# EAGLE design V7B TI (EAGLE 6.4)

## Sheet 1 of 3
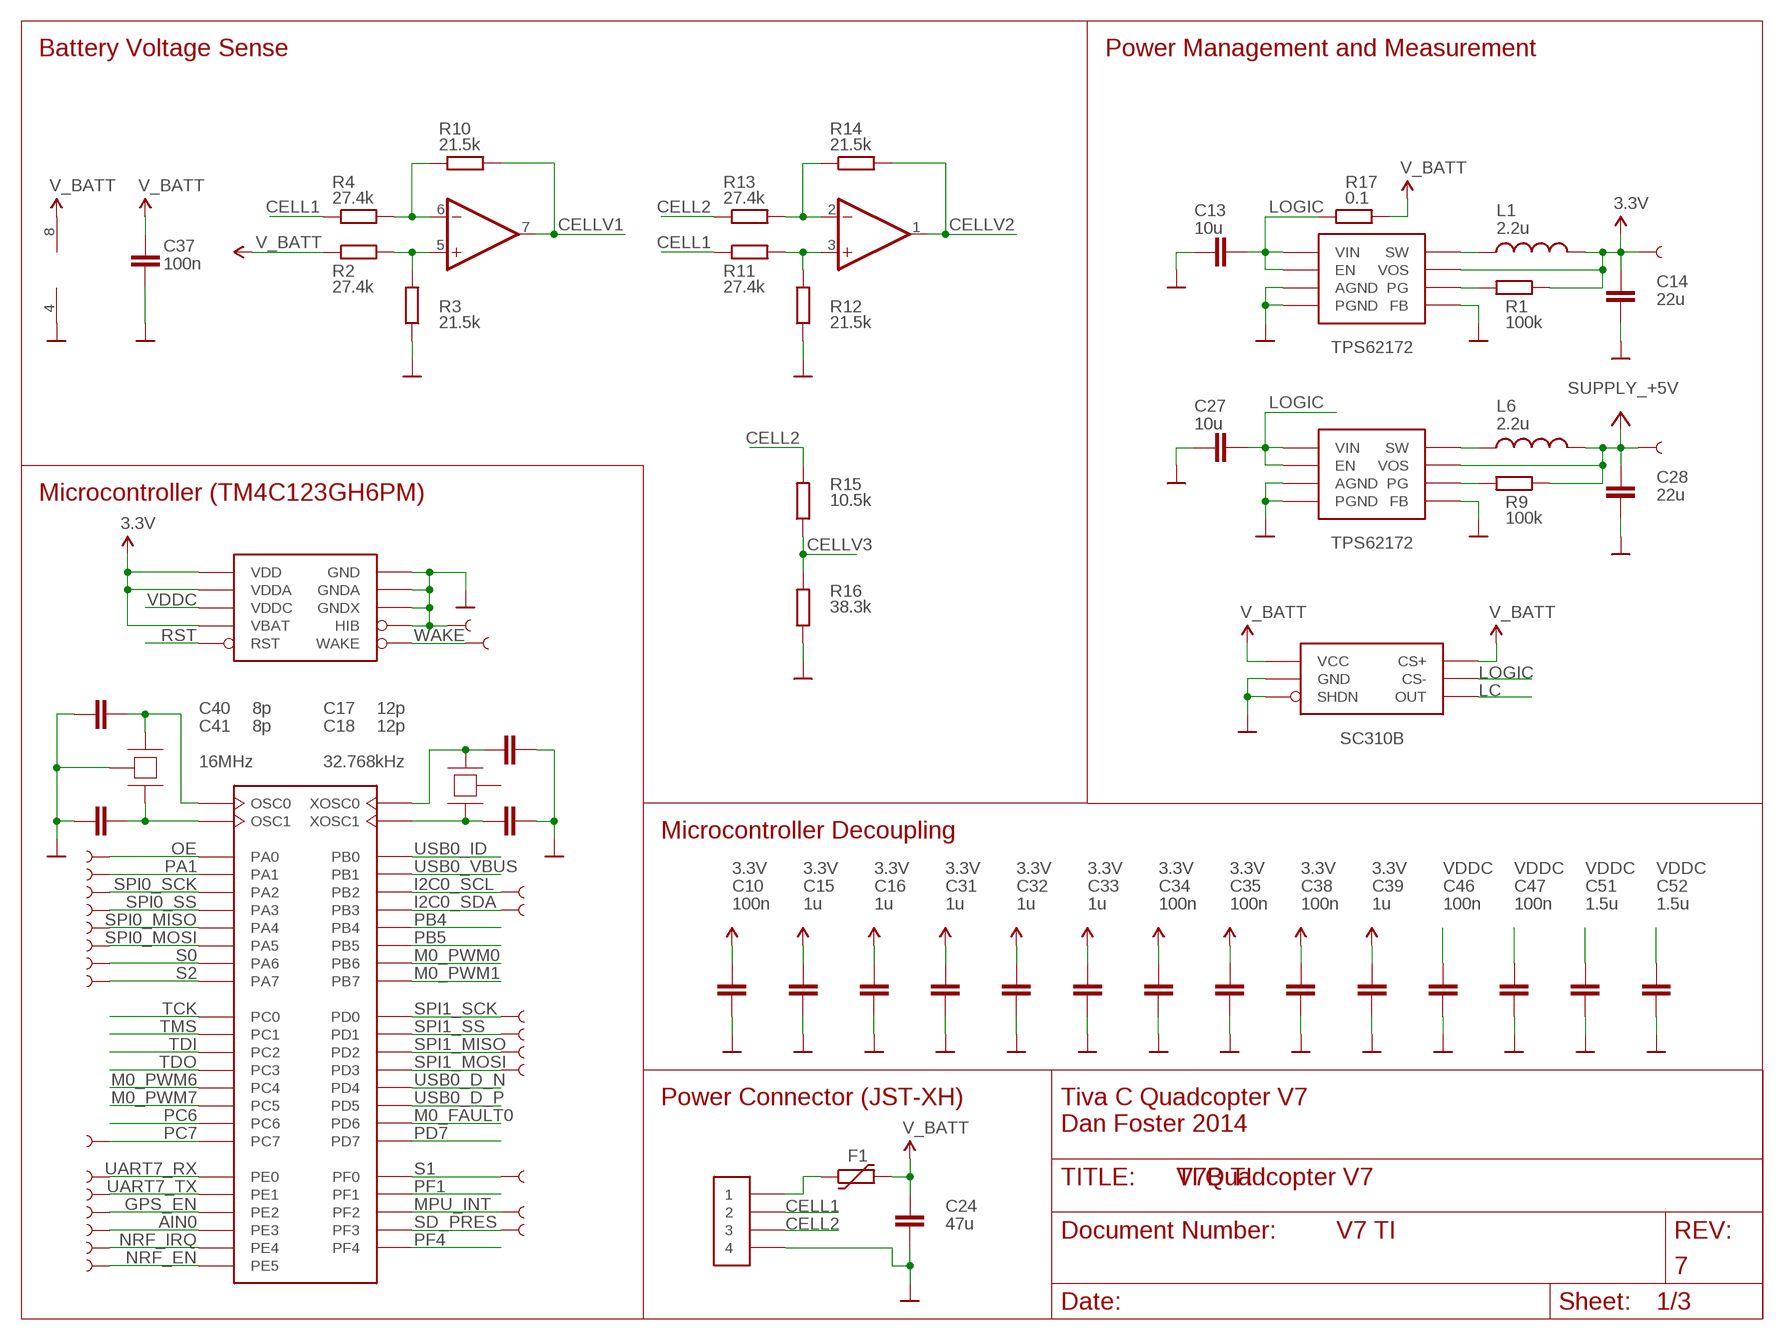
[diagram p0: schematic, sheet 1]

### Parts
C10  100n  CAPACITOR_NPOL-0402  [C402]
C13  10u  CAPACITOR_NPOL-0805  [C805]
C14  22u  CAPACITOR_NPOL-0805  [C805]
C15  1u  CAPACITOR_NPOL-0402  [C402]
C16  1u  CAPACITOR_NPOL-0402  [C402]
C17  12p  CAPACITOR_NPOL-0402  [C402]
C18  12p  CAPACITOR_NPOL-0402  [C402]
C24  47u  CAPACITOR_NPOL-1206  [C1206]
C27  10u  CAPACITOR_NPOL-0805  [C805]
C28  22u  CAPACITOR_NPOL-0805  [C805]
C31  1u  CAPACITOR_NPOL-0402  [C402]
C32  1u  CAPACITOR_NPOL-0402  [C402]
C33  1u  CAPACITOR_NPOL-0402  [C402]
C34  100n  CAPACITOR_NPOL-0402  [C402]
C35  100n  CAPACITOR_NPOL-0402  [C402]
C37  100n  CAPACITOR_NPOL-0402  [C402]
C38  100n  CAPACITOR_NPOL-0402  [C402]
C39  1u  CAPACITOR_NPOL-0402  [C402]
C40  8p  CAPACITOR_NPOL-0402  [C402]
C41  8p  CAPACITOR_NPOL-0402  [C402]
C46  100n  CAPACITOR_NPOL-0402  [C402]
C47  100n  CAPACITOR_NPOL-0402  [C402]
C51  1.5u  CAPACITOR_NPOL-0402  [C402]
C52  1.5u  CAPACITOR_NPOL-0402  [C402]
F1  FUSE_PTC-1812  [PTC1812L]
IC2  OPA2743EA  [MSOP08]
L1  2.2u  INDUCTOR1210  [1210]
L6  2.2u  INDUCTOR1210  [1210]
R1  100k  RESISTOR-0402  [R402]
R2  27.4k  RESISTOR-0402  [R402]
R3  21.5k  RESISTOR-0402  [R402]
R4  27.4k  RESISTOR-0402  [R402]
R9  100k  RESISTOR-0402  [R402]
R10  21.5k  RESISTOR-0402  [R402]
R11  27.4k  RESISTOR-0402  [R402]
R12  21.5k  RESISTOR-0402  [R402]
R13  27.4k  RESISTOR-0402  [R402]
R14  21.5k  RESISTOR-0402  [R402]
R15  10.5k  RESISTOR-0402  [R402]
R16  38.3k  RESISTOR-0402  [R402]
R17  0.1  RESISTOR-1206  [R1206]
TP1  TEST-POINT3  [PAD.03X.03]
TP2  TEST-POINT3  [PAD.03X.03]
TP3  TEST-POINT3  [PAD.03X.03]
TP4  TEST-POINT3  [PAD.03X.03]
TP5  TEST-POINT3  [PAD.03X.03]
TP6  TEST-POINT3  [PAD.03X.03]
TP7  TEST-POINT3  [PAD.03X.03]
TP8  TEST-POINT3  [PAD.03X.03]
TP9  TEST-POINT3  [PAD.03X.03]
TP10  TEST-POINT3  [PAD.03X.03]
TP11  TEST-POINT3  [PAD.03X.03]
TP12  TEST-POINT3  [PAD.03X.03]
TP13  TEST-POINT3  [PAD.03X.03]
TP14  TEST-POINT3  [PAD.03X.03]
TP15  TEST-POINT3  [PAD.03X.03]
TP16  TEST-POINT3  [PAD.03X.03]
TP17  TEST-POINT3  [PAD.03X.03]
TP18  TEST-POINT3  [PAD.03X.03]
TP19  TEST-POINT3  [PAD.03X.03]
TP20  TEST-POINT3  [PAD.03X.03]
TP21  TEST-POINT3  [PAD.03X.03]
TP22  TEST-POINT3  [PAD.03X.03]
TP23  TEST-POINT3  [PAD.03X.03]
TP24  TEST-POINT3  [PAD.03X.03]
TP25  TEST-POINT3  [PAD.03X.03]
TP26  TEST-POINT3  [PAD.03X.03]
TP27  TEST-POINT3  [PAD.03X.03]
TP29  TEST-POINT3  [PAD.03X.03]
U$2  TPS62172  [S-PWSON-N8]
U$4  TPS62172  [S-PWSON-N8]
U$5  TM4C123GH6PM  [TI-PM]
U$6  JST-XH-4-SMD  [JST-XH-4-SMD]
U$7  CRYSTAL-3.2X2.5  [TSX-3225]
U$9  SC130  [SOT-23-6]
U$12  CRYSTAL-WATCH-SMD  [CRYSTAL-WATCH-SMD]

### Nets
3.3V: C10.1 C14.2 C15.1 C16.1 C31.1 C32.1 C33.1 C34.1 C35.1 C38.1 C39.1 L1.2 R1.1 TP15.P$1 U$2.6(VOS) U$5.P$2(VDDA) U$5.P$11(VDD) U$5.P$26(VDD) U$5.P$37(VBAT) U$5.P$42(VDD) U$5.P$54(VDD) ; also sheet 2,3
+5V: C28.2 L6.2 R9.1 TP14.P$1 U$4.6(VOS) ; supply symbol labelled SUPPLY_+5V ; also sheet 3
AIN0: TP11.P$1 U$5.P$6(PE3) ; also sheet 3
CELL1: R4.1 R11.1 U$6.2
CELL2: R13.1 R15.2 U$6.3
CELLV1: IC2.7(B:OUT) R10.2 ; also sheet 3
CELLV2: IC2.1(A:OUT) R14.2 ; also sheet 3
CELLV3: R15.1 R16.2 ; also sheet 3
GND: C10.2 C13.2 C14.1 C15.2 C16.2 C17.2 C18.2 C24.2 C27.2 C28.1 C31.2 C32.2 C33.2 C34.2 C35.2 C37.2 C38.2 C39.2 C40.1 C41.1 C46.2 C47.2 C51.2 C52.2 IC2.4(P:V-) R3.1 R12.1 R16.1 TP16.P$1 U$2.1(PGND) U$2.4(AGND) U$2.5(FB) U$2.PAD(AGND) U$2.VIA1(AGND) U$2.VIA2(AGND) U$4.1(PGND) U$4.4(AGND) U$4.5(FB) U$4.PAD(AGND) U$4.VIA1(AGND) U$4.VIA2(AGND) U$5.P$3(GNDA) U$5.P$12(GND) U$5.P$27(GND) U$5.P$33(HIB) U$5.P$35(GNDX) U$5.P$39(GND) U$5.P$55(GND) U$6.4 U$7.G1(CASE) U$7.G2(CASE) U$9.1(SHDN) U$9.2(GND) ; supply symbol labelled SUPPLY_GND ; also sheet 2,3
GPS_EN: TP21.P$1 U$5.P$7(PE2) ; also sheet 2
I2C0_SCL: TP5.P$1 U$5.P$47(PB2) ; also sheet 2
I2C0_SDA: TP6.P$1 U$5.P$48(PB3) ; also sheet 2
LC: U$9.6(OUT) ; also sheet 3
LOGIC: C13.1 C27.1 R17.1 U$2.2(VIN) U$2.3(EN) U$4.2(VIN) U$4.3(EN) U$9.5(CS-)
M0_FAULT0: U$5.P$53(PD6)
M0_PWM0: U$5.P$1(PB6) ; also sheet 3
M0_PWM1: U$5.P$4(PB7) ; also sheet 3
M0_PWM6: U$5.P$16(PC4) ; also sheet 3
M0_PWM7: U$5.P$15(PC5) ; also sheet 3
MPU_INT: TP29.P$1 U$5.P$30(PF2) ; also sheet 2
N$6: IC2.5(B:+IN) R2.2 R3.2
N$7: L1.1 U$2.7(SW)
N$8: C17.1 U$5.P$34(XOSC0) U$12.2(C2)
N$9: R1.2 U$2.8(PG)
N$10: IC2.6(B:-IN) R4.2 R10.1
N$11: C18.1 U$5.P$36(XOSC1) U$12.1(C1)
N$16: L6.1 U$4.7(SW)
N$19: R9.2 U$4.8(PG)
N$20: F1.1 U$6.1
N$24: IC2.3(A:+IN) R11.2 R12.2
N$25: IC2.2(A:-IN) R13.2 R14.1
N$27: C40.2 U$5.P$40(OSC0) U$7.C1
N$30: C41.2 U$5.P$41(OSC1) U$7.C2
NRF_EN: TP19.P$1 U$5.P$60(PE5) ; also sheet 2,3
NRF_IRQ: TP18.P$1 U$5.P$59(PE4) ; also sheet 2
OE: TP24.P$1 U$5.P$17(PA0) ; also sheet 3
PA1: TP25.P$1 U$5.P$18(PA1)
PB4: U$5.P$58(PB4)
PB5: U$5.P$57(PB5)
PC6: U$5.P$14(PC6)
PC7: TP27.P$1 U$5.P$13(PC7)
PD7: U$5.P$10(PD7)
PF1: U$5.P$29(PF1)
PF4: U$5.P$5(PF4)
RST: U$5.P$38(RST) ; also sheet 2,3
S0: TP12.P$1 U$5.P$23(PA6) ; also sheet 3
S1: TP10.P$1 U$5.P$28(PF0) ; also sheet 3
S2: TP13.P$1 U$5.P$24(PA7) ; also sheet 3
SD_PRES: TP20.P$1 U$5.P$31(PF3) ; also sheet 2
SPI0_MISO: TP3.P$1 U$5.P$21(PA4) ; also sheet 2,3
SPI0_MOSI: TP4.P$1 U$5.P$22(PA5) ; also sheet 2
SPI0_SCK: TP1.P$1 U$5.P$19(PA2) ; also sheet 2
SPI0_SS: TP2.P$1 U$5.P$20(PA3) ; also sheet 2,3
SPI1_MISO: TP9.P$1 U$5.P$63(PD2) ; also sheet 2,3
SPI1_MOSI: TP17.P$1 U$5.P$64(PD3) ; also sheet 2
SPI1_SCK: TP7.P$1 U$5.P$61(PD0) ; also sheet 2
SPI1_SS: TP8.P$1 U$5.P$62(PD1) ; also sheet 2,3
TCK: U$5.P$52(PC0) ; also sheet 2
TDI: U$5.P$50(PC2) ; also sheet 2
TDO: U$5.P$49(PC3) ; also sheet 2
TMS: U$5.P$51(PC1) ; also sheet 2
UART7_RX: TP23.P$1 U$5.P$9(PE0) ; also sheet 2
UART7_TX: TP22.P$1 U$5.P$8(PE1) ; also sheet 2
USB0_D_N: U$5.P$43(PD4)
USB0_D_P: U$5.P$44(PD5)
USB0_ID: U$5.P$45(PB0)
USB0_VBUS: U$5.P$46(PB1)
V_BATT: C24.1 C37.1 F1.2 IC2.8(P:V+) R2.1 R17.2 U$9.3(VCC) U$9.4(CS+)
VDDC: C46.1 C47.1 C51.1 C52.1 U$5.P$25(VDDC) U$5.P$56(VDDC)
WAKE: TP26.P$1 U$5.P$32(WAKE) ; also sheet 3

### Notes on the sheet
- Battery Voltage Sense | Power Management and Measurement
- TPS62172
- Microcontroller (TM4C123GH6PM)
- TPS62172
- SC310B
- 16MHz | 32.768kHz
- Microcontroller Decoupling
- Power Connector (JST-XH)
- Tiva C Quadcopter V7
  Dan Foster 2014
- TI Quadcopter V7
- V7 TI
- 7

## Sheet 2 of 3
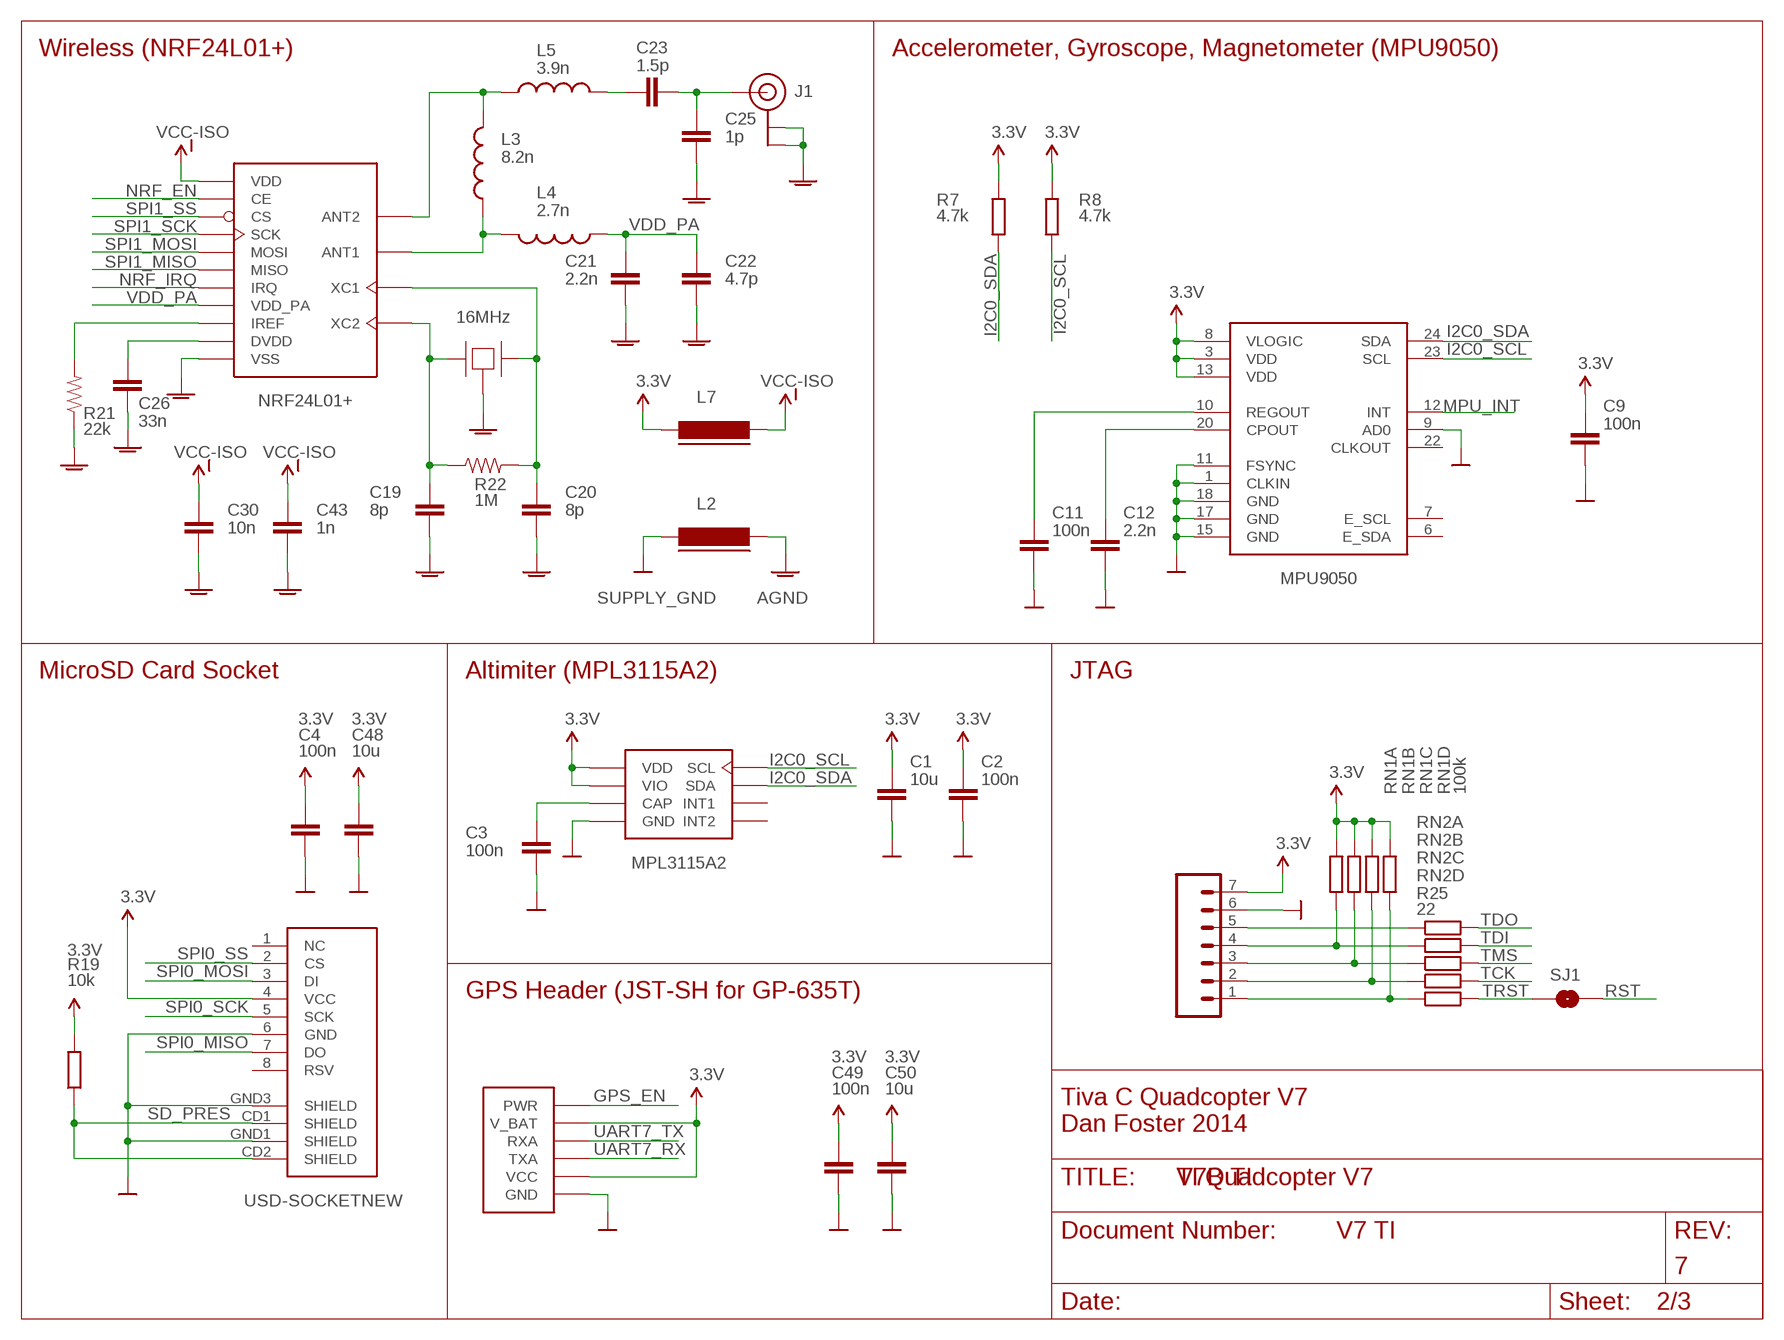
[diagram p1: schematic, sheet 2]

### Parts
C1  10u  CAPACITOR_NPOL-0603  [C603]
C2  100n  CAPACITOR_NPOL-0402  [C402]
C3  100n  CAPACITOR_NPOL-0402  [C402]
C4  100n  CAPACITOR_NPOL-0402  [C402]
C9  100n  CAPACITOR_NPOL-0402  [C402]
C11  100n  CAPACITOR_NPOL-0402  [C402]
C12  2.2n  CAPACITOR_NPOL-0402  [C402]
C19  8p  CAP0402-CAP  [0402-CAP]
C20  8p  CAP0402-CAP  [0402-CAP]
C21  2.2n  CAP0402-CAP  [0402-CAP]
C22  4.7p  CAP0402-CAP  [0402-CAP]
C23  1.5p  CAP0402-CAP  [0402-CAP]
C25  1p  CAP0402-CAP  [0402-CAP]
C26  33n  CAP0402-CAP  [0402-CAP]
C30  10n  CAP0402-CAP  [0402-CAP]
C43  1n  CAP0402-CAP  [0402-CAP]
C48  10u  CAPACITOR_NPOL-0603  [C603]
C49  100n  CAPACITOR_NPOL-0402  [C402]
C50  10u  CAPACITOR_NPOL-0603  [C603]
J1  U.FL  [U.FL]
JP5  M07  [1X07]
L2  445-8677-1-ND  FERRITE-0603  [FB603]
L3  8.2n  INDUCTOR0402  [C0402]
L4  2.7n  INDUCTOR0402  [C0402]
L5  3.9n  INDUCTOR0402  [C0402]
L7  445-8677-1-ND  FERRITE-0603  [FB603]
R7  4.7k  RESISTOR-0402  [R402]
R8  4.7k  RESISTOR-0402  [R402]
R19  10k  RESISTOR-0402  [R402]
R21  22k  RESISTOR0402-RES  [0402-RES]
R22  1M  RESISTOR0402-RES  [0402-RES]
R25  22  RESISTOR-0402  [R402]
RN1  100k  RESISTOR_ARRAY_4  [RN8P-4R-CRA06S]
RN2  22  RESISTOR_ARRAY_4  [RN8P-4R-CRA06S]
SJ1  SOLDERJUMPERNO  [SJ_2S-NO]
U1  MPU9050  MPU-9150QFN-24-NP  [QFN-24-NP]
U2  USD-SOCKETNEW  [MICRO-SD-SOCKET-PP]
U$3  MPL3115A2  [MPLXXXXAX]
U$10  GPS-GP-635T-VERT  [JST-SH-6-SMD-T]
U$11  NRF24L01+  [QFN-20-4X4-0.5]
U$13  CRYSTAL-3.2X2.5  [TSX-3225]

### Nets
3.3V: C1.1 C2.1 C4.1 C9.1 C48.1 C49.1 C50.1 JP5.7 L7.1 R7.1 R8.1 R19.2 RN1.5 RN1.6 RN1.7 RN1.8 U1.3(VDD) U1.8(VLOGIC) U1.13(VDD) U2.4(VCC) U$3.1(VDD) U$3.4(VIO) U$10.2(VCC) U$10.5(V_BAT) ; also sheet 1,3
AGND: C19.2 C20.2 C21.2 C22.2 C25.2 C26.2 C30.2 C43.2 J1.P$1(GND) J1.P$2(GND) L2.2 R21.1 U$11.P$8(VSS) U$11.P$14(VSS) U$11.P$17(VSS) U$11.P$20(VSS) U$13.G1(CASE) U$13.G2(CASE)
GND: C1.2 C2.2 C3.2 C4.2 C9.2 C11.2 C12.2 C48.2 C49.2 C50.2 JP5.6 L2.1 U1.1(CLKIN) U1.9(AD0) U1.11(FSYNC) U1.15(GND) U1.17(GND) U1.18(GND) U2.6(GND) U2.GND1(SHIELD) U2.GND3(SHIELD) U$3.3(GND) U$10.1(GND) ; supply symbol labelled SUPPLY_GND ; also sheet 1,3
GPS_EN: U$10.6(PWR) ; also sheet 1
I2C0_SCL: R8.2 U1.23(SCL) U$3.8(SCL) ; also sheet 1
I2C0_SDA: R7.2 U1.24(SDA) U$3.7(SDA) ; also sheet 1
MPU_INT: U1.12(INT) ; also sheet 1
N$3: C12.1 U1.20(CPOUT)
N$4: C11.1 U1.10(REGOUT)
N$15: C19.1 R22.1 U$11.P$9(XC2) U$13.C1
N$17: C20.1 R22.2 U$11.P$10(XC1) U$13.C2
N$21: C3.1 U$3.2(CAP)
N$22: C23.2 C25.1 J1.P$3(SIGNAL)
N$23: C26.1 U$11.P$19(DVDD)
N$26: L3.1 L4.2 U$11.P$12(ANT1)
N$28: L3.2 L5.1 U$11.P$13(ANT2)
N$29: C23.1 L5.2
N$31: R21.2 U$11.P$16(IREF)
N$34: JP5.5 RN2.1
N$35: JP5.4 RN1.1 RN2.2
N$37: JP5.3 RN1.2 RN2.3
N$38: JP5.2 RN1.3 RN2.4
N$39: JP5.1 R25.1 RN1.4
NRF_EN: U$11.P$1(CE) ; also sheet 1,3
NRF_IRQ: U$11.P$6(IRQ) ; also sheet 1
RST: SJ1.2 ; also sheet 1,3
SD_PRES: R19.1 U2.CD1(SHIELD) U2.CD2(SHIELD) ; also sheet 1
SPI0_MISO: U2.7(DO) ; also sheet 1,3
SPI0_MOSI: U2.3(DI) ; also sheet 1
SPI0_SCK: U2.5(SCK) ; also sheet 1
SPI0_SS: U2.2(CS) ; also sheet 1,3
SPI1_MISO: U$11.P$5(MISO) ; also sheet 1,3
SPI1_MOSI: U$11.P$4(MOSI) ; also sheet 1
SPI1_SCK: U$11.P$3(SCK) ; also sheet 1
SPI1_SS: U$11.P$2(CS) ; also sheet 1,3
TCK: RN2.5 ; also sheet 1
TDI: RN2.7 ; also sheet 1
TDO: RN2.8 ; also sheet 1
TMS: RN2.6 ; also sheet 1
TRST: R25.2 SJ1.1
UART7_RX: U$10.3(TXA) ; also sheet 1
UART7_TX: U$10.4(RXA) ; also sheet 1
VCC-ISO: C30.1 C43.1 L7.2 U$11.P$7(VDD) U$11.P$15(VDD) U$11.P$18(VDD)
VDD_PA: C21.1 C22.1 L4.1 U$11.P$11(VDD_PA)
Unconnected: U1.6(E_SDA) U1.7(E_SCL) U1.22(CLKOUT) U2.1(NC) U2.8(RSV) U$3.5(INT2) U$3.6(INT1)

### Notes on the sheet
- Wireless (NRF24L01+) | Accelerometer, Gyroscope, Magnetometer (MPU9050)
- 16MHz
- MicroSD Card Socket | Altimiter (MPL3115A2) | JTAG
- MPL3115A2
- GPS Header (JST-SH for GP-635T)
- Tiva C Quadcopter V7
  Dan Foster 2014
- TI Quadcopter V7
- V7 TI
- 7

## Sheet 3 of 3
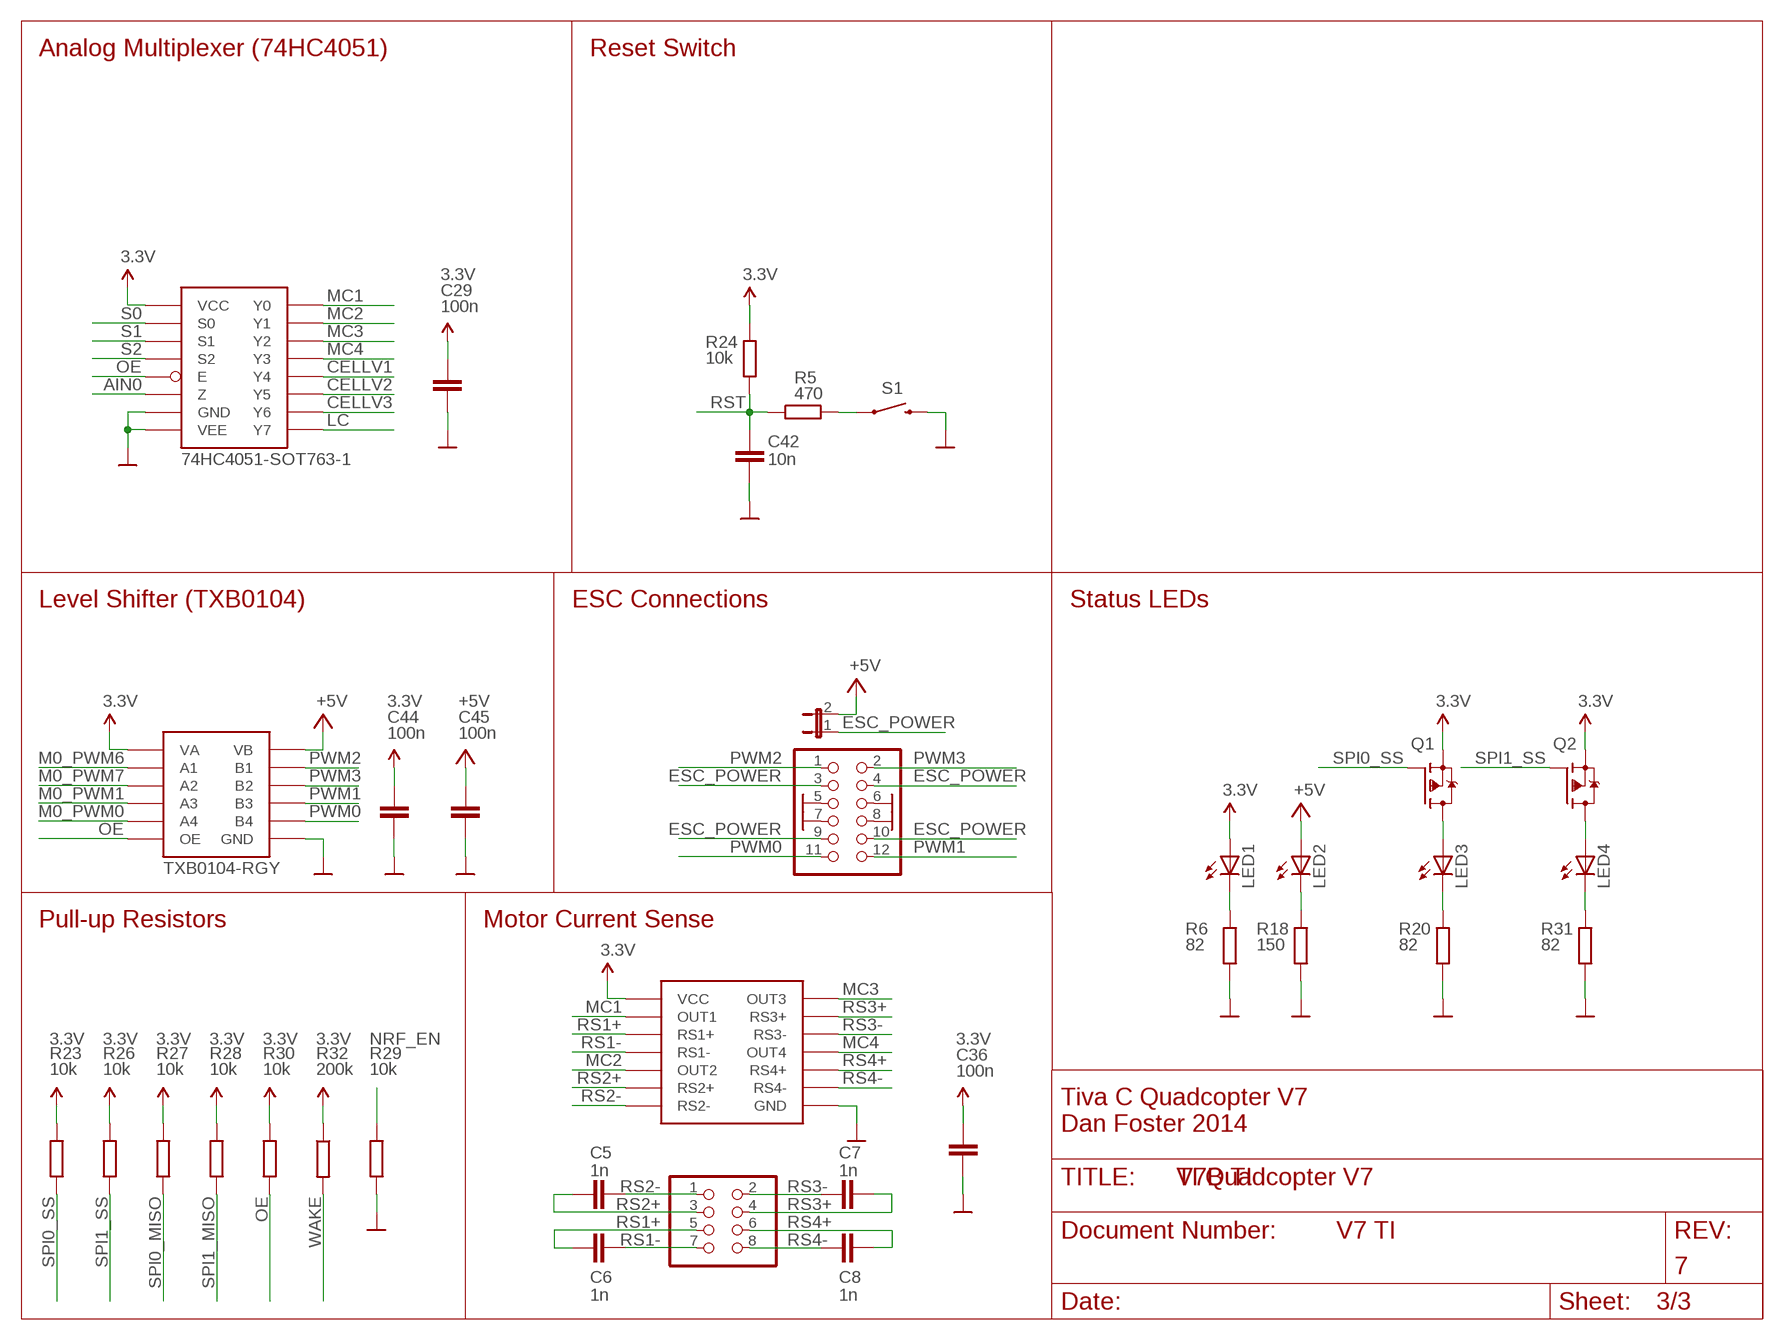
[diagram p2: schematic, sheet 3]

### Parts
C5  1n  CAPACITOR_NPOL-0402  [C402]
C6  1n  CAPACITOR_NPOL-0402  [C402]
C7  1n  CAPACITOR_NPOL-0402  [C402]
C8  1n  CAPACITOR_NPOL-0402  [C402]
C29  100n  CAPACITOR_NPOL-0402  [C402]
C36  100n  CAPACITOR_NPOL-0402  [C402]
C42  10n  CAPACITOR_NPOL-0402  [C402]
C44  100n  CAPACITOR_NPOL-0402  [C402]
C45  100n  CAPACITOR_NPOL-0402  [C402]
JP1  PINHD-2X6  [2X06]
JP2  PINHD-2X4  [2X04]
JP3  JUMPER-2SMD-NO  [SJ_2S-NO]
LED1  LED-0603  [LED-603]
LED2  LED-0603  [LED-603]
LED3  LED-0603  [LED-603]
LED4  LED-0603  [LED-603]
Q1  BSS84CT-ND  TRANSISTOR_FET_TSM2301CX  [SOT-23]
Q2  BSS84CT-ND  TRANSISTOR_FET_TSM2301CX  [SOT-23]
R5  470  RESISTOR-0402  [R402]
R6  82  RESISTOR-0603  [R603]
R18  150  RESISTOR-0603  [R603]
R20  82  RESISTOR-0603  [R603]
R23  10k  RESISTOR-0402  [R402]
R24  10k  RESISTOR-0402  [R402]
R26  10k  RESISTOR-0402  [R402]
R27  10k  RESISTOR-0402  [R402]
R28  10k  RESISTOR-0402  [R402]
R29  10k  RESISTOR-0402  [R402]
R30  10k  RESISTOR-0402  [R402]
R31  82  RESISTOR-0603  [R603]
R32  200k  RESISTOR-0402  [R402]
S1  SWITCH-MOMENTARY-2SMD  [TACTILE_SWITCH_SMD]
U$1  MAX4378XAUD+  [TSSOP-14]
U$8  74HC4051  [NXP-SOT763-1]
U$18  TXB0104-RGY  [TI-RGY]

### Nets
3.3V: C29.1 C36.1 C44.1 LED1.A Q1.2(S) Q2.2(S) R23.2 R24.2 R26.2 R27.2 R28.2 R30.2 R32.1 U$1.P$4(VCC) U$8.16(VCC) U$8.PAD(VCC) U$18.1(VA) ; also sheet 1,2
+5V: C45.1 JP3.2 LED2.A U$18.14(VB) ; supply symbol labelled SUPPLY_+5V ; also sheet 1
AIN0: U$8.3(Z) ; also sheet 1
CELLV1: U$8.1(Y4) ; also sheet 1
CELLV2: U$8.5(Y5) ; also sheet 1
CELLV3: U$8.2(Y6) ; also sheet 1
ESC_POWER: JP1.3 JP1.4 JP1.9 JP1.10 JP3.1
GND: C29.2 C36.2 C42.2 C44.2 C45.2 JP1.5 JP1.6 JP1.7 JP1.8 R6.2 R18.2 R20.2 R29.1 R31.2 S1.3 U$1.P$11(GND) U$8.7(VEE) U$8.8(GND) U$18.7(GND) U$18.PAD(GND) U$18.V1(GND) U$18.V2(GND) U$18.V3(GND) U$18.V4(GND) ; supply symbol labelled SUPPLY_GND ; also sheet 1,2
LC: U$8.4(Y7) ; also sheet 1
M0_PWM0: U$18.5(A4) ; also sheet 1
M0_PWM1: U$18.4(A3) ; also sheet 1
M0_PWM6: U$18.2(A1) ; also sheet 1
M0_PWM7: U$18.3(A2) ; also sheet 1
MC1: U$1.P$1(OUT1) U$8.13(Y0)
MC2: U$1.P$7(OUT2) U$8.14(Y1)
MC3: U$1.P$8(OUT3) U$8.15(Y2)
MC4: U$1.P$14(OUT4) U$8.12(Y3)
N$2: LED1.C R6.1
N$5: R5.2 S1.1
N$12: LED2.C R18.1
N$13: LED3.A Q1.3(D)
N$14: LED3.C R20.1
N$18: LED4.C R31.1
N$32: LED4.A Q2.3(D)
NRF_EN: R29.2 ; also sheet 1,2
OE: R30.1 U$8.6(E) U$18.8(OE) ; also sheet 1
PWM0: JP1.11 U$18.10(B4)
PWM1: JP1.12 U$18.11(B3)
PWM2: JP1.1 U$18.13(B1)
PWM3: JP1.2 U$18.12(B2)
RS1+: C6.1 JP2.5 U$1.P$3(RS1+)
RS1-: C6.2 JP2.7 U$1.P$2(RS1-)
RS2+: C5.1 JP2.3 U$1.P$5(RS2+)
RS2-: C5.2 JP2.1 U$1.P$6(RS2-)
RS3+: C7.2 JP2.4 U$1.P$10(RS3+)
RS3-: C7.1 JP2.2 U$1.P$9(RS3-)
RS4+: C8.2 JP2.6 U$1.P$12(RS4+)
RS4-: C8.1 JP2.8 U$1.P$13(RS4-)
RST: C42.1 R5.1 R24.1 ; also sheet 1,2
S0: U$8.11(S0) ; also sheet 1
S1: U$8.10(S1) ; also sheet 1
S2: U$8.9(S2) ; also sheet 1
SPI0_MISO: R27.1 ; also sheet 1,2
SPI0_SS: Q1.1(G) R23.1 ; also sheet 1,2
SPI1_MISO: R28.1 ; also sheet 1,2
SPI1_SS: Q2.1(G) R26.1 ; also sheet 1,2
WAKE: R32.2 ; also sheet 1

### Notes on the sheet
- Analog Multiplexer (74HC4051) | Reset Switch
- 74HC4051-SOT763-1
- Level Shifter (TXB0104) | ESC Connections | Status LEDs
- Pull-up Resistors | Motor Current Sense
- Tiva C Quadcopter V7
  Dan Foster 2014
- TI Quadcopter V7
- V7 TI
- 7

## Power pins joined to a net without a drawn wire
CASE: U$12.BODY(CASE)

## Library data of the parts
C1-C18 C24 C27-C29 C31-C42 C44-C52 = dp_devices:CAPACITOR_NPOL: Non-Polarized capacitor in various packages
C19-C23 C25 C26 C30 C43 = SparkFun-Capacitors:CAP: Capacitor Standard 0603 ceramic capacitor, and 0.1" leaded capacitor.
F1 = dp_devices:FUSE_PTC: Resettable PTC
IC2 = linear:OPA2743: 12V, 7MHz, CMOS, Rail-to-Rail I/O Dual OP AMP Source: http://focus.ti.com/lit/ds/sbos201/sbos201.pdf
J1 = SparkFun-Connectors:U.FL: SMD antenna connector- WRL-09144; PROD_ID: CONN-09193; VALUE: U.FL
JP1 = pinhead:PINHD-2X6: PIN HEADER
JP2 = pinhead:PINHD-2X4: PIN HEADER
JP3 = SparkFun-Passives:JUMPER-2: Jumper Basic 0.1" spaced jumper. Use with breakaway headers.
JP5 = SparkFun-Connectors:M07: Header 7 Standard 7-pin 0.1" header. Use with straight break away headers (SKU : PRT-00116), right angle break away headers (PRT-00553), swiss pins (PRT-00743), machine pins (PRT-00117), and female headers (PRT-00115). NOTES ON THE VARIANTS LOCK and LOCK_LONGPADS... This footprint was designed to help hold the alignment of a through-hole component (i.e. 7-pin header) while soldering it into place. You may notice that each hole has been shifted either up or down by 0.005 of an inch from it's more standard position (which is usually a perfectly straight line). This slight alteration caused the pins (the squares in the middle) to touch the edges of the holes. Because they are alternating, it causes a "brace" to hold the header in place. 0.005 has proven to be the perfect amount of "off-center" position when using our standard breakaway headers. Although looks a little odd when you look at the bare footprint, once you have a header in there, the alteration is very hard to notice. Also, if you push a header all the way into place, it is covered up entirely on the bottom side. This idea of altering the position of holes to aid alignment will be further integrated into the Sparkfun Library for other footprints. It can help hold any component with 3 or more connection pins.
L1 L3-L6 = SparkFun-Passives:INDUCTOR: Inductors Basic Inductor/Choke - 0603 and 1206. Footprints are not proven and vary greatly between part numbers. SRN6045- 33uH, 20% 1.4A SDR0403-560KL - 56uH, 10%, 500mA RMS/740mA peak
L2 L7 = dp_devices:FERRITE: Ferrite bead in various packages
LED1-LED4 = dp_devices:LED: Light Emitting Diode
Q1 Q2 = dp_devices:TRANSISTOR_FET_TSM2301CX: 20V P-Channel Enhancement Mode MOSFET
R1-R20 R23-R32 = dp_devices:RESISTOR
R21 R22 = SparkFun-Passives:RESISTOR: Resistor Basic schematic elements and footprints for 0603, 1206, and PTH resistors.
RN1 RN2 = dp_devices:RESISTOR_ARRAY_4: 4 Resistor Array 0603
S1 = SparkFun-Electromechanical:SWITCH-MOMENTARY-2: Various NO switches- pushbuttons, reed, etc; PROD_ID: SWCH-08247
SJ1 = SparkFun-Passives:SOLDERJUMPER: Solder Jumper Standard SMD solder jumper. Used to automate production. Two varients : Normally Open and Normally Closed are the same, but have different paste layers. NC will have a large amount of paste and should jumper during reflow.
TP1-TP27 TP29 = SparkFun-Passives:TEST-POINT: Bare copper test points for troubleshooting or ICT
U1 = SparkFun-Sensors:MPU-9150: 9DOF (3mag, 3accel, 3rotat). I2C interface.
U2 = SparkFun-Connectors:USD-SOCKET: microSD Socket Push-push type uSD socket. Schematic element and footprint production proven. Spark Fun Electronics SKU : PRT-00127. tDoc lines correctly indicate media card edge positions when inserting (unlocked, locked, depressed).
U$1 = blackbox:MAX4378
U$2 U$4 = customParts:TPS62172
U$3 = blackbox:MPL
U$5 = blackbox:TM4C123GH6PM
U$6 = blackbox:JST
U$7 U$12 U$13 = blackbox:CRYSTAL
U$8 = blackbox:74HC4051
U$9 = blackbox:SC130
U$10 = blackbox:GPS
U$11 = blackbox:NRF24L01+
U$18 = blackbox:TXB0104

## Board
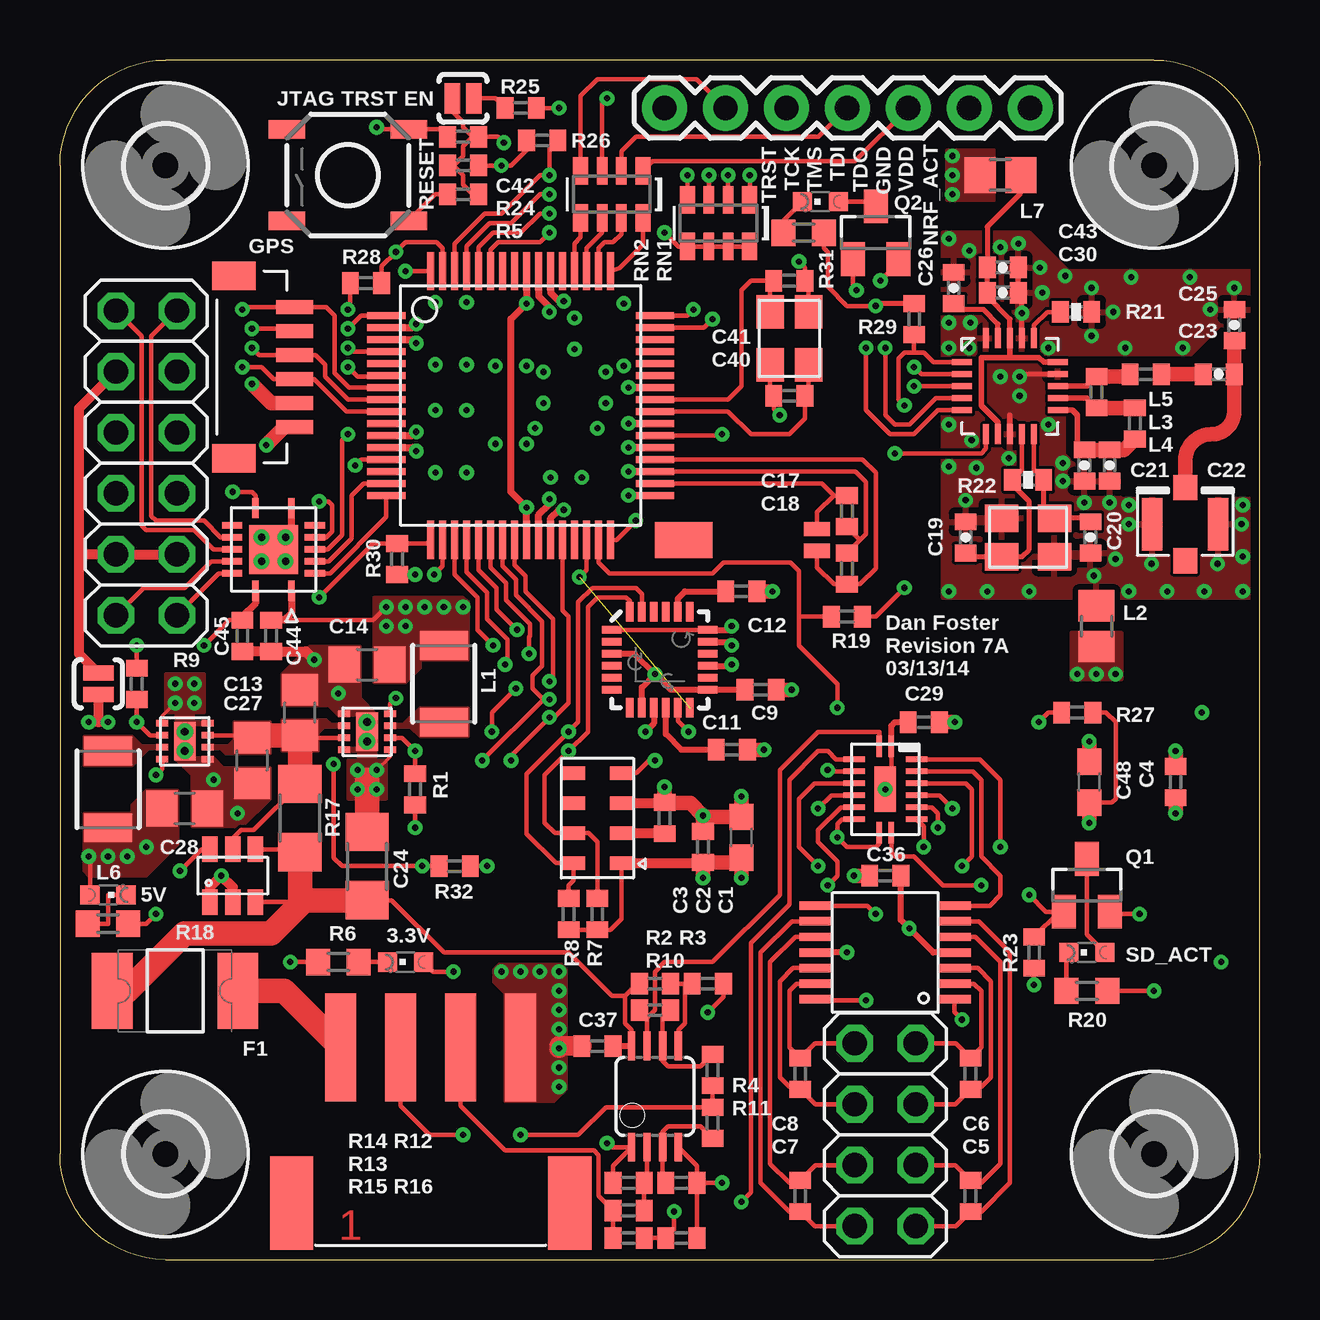
[diagram p3: board, top side]
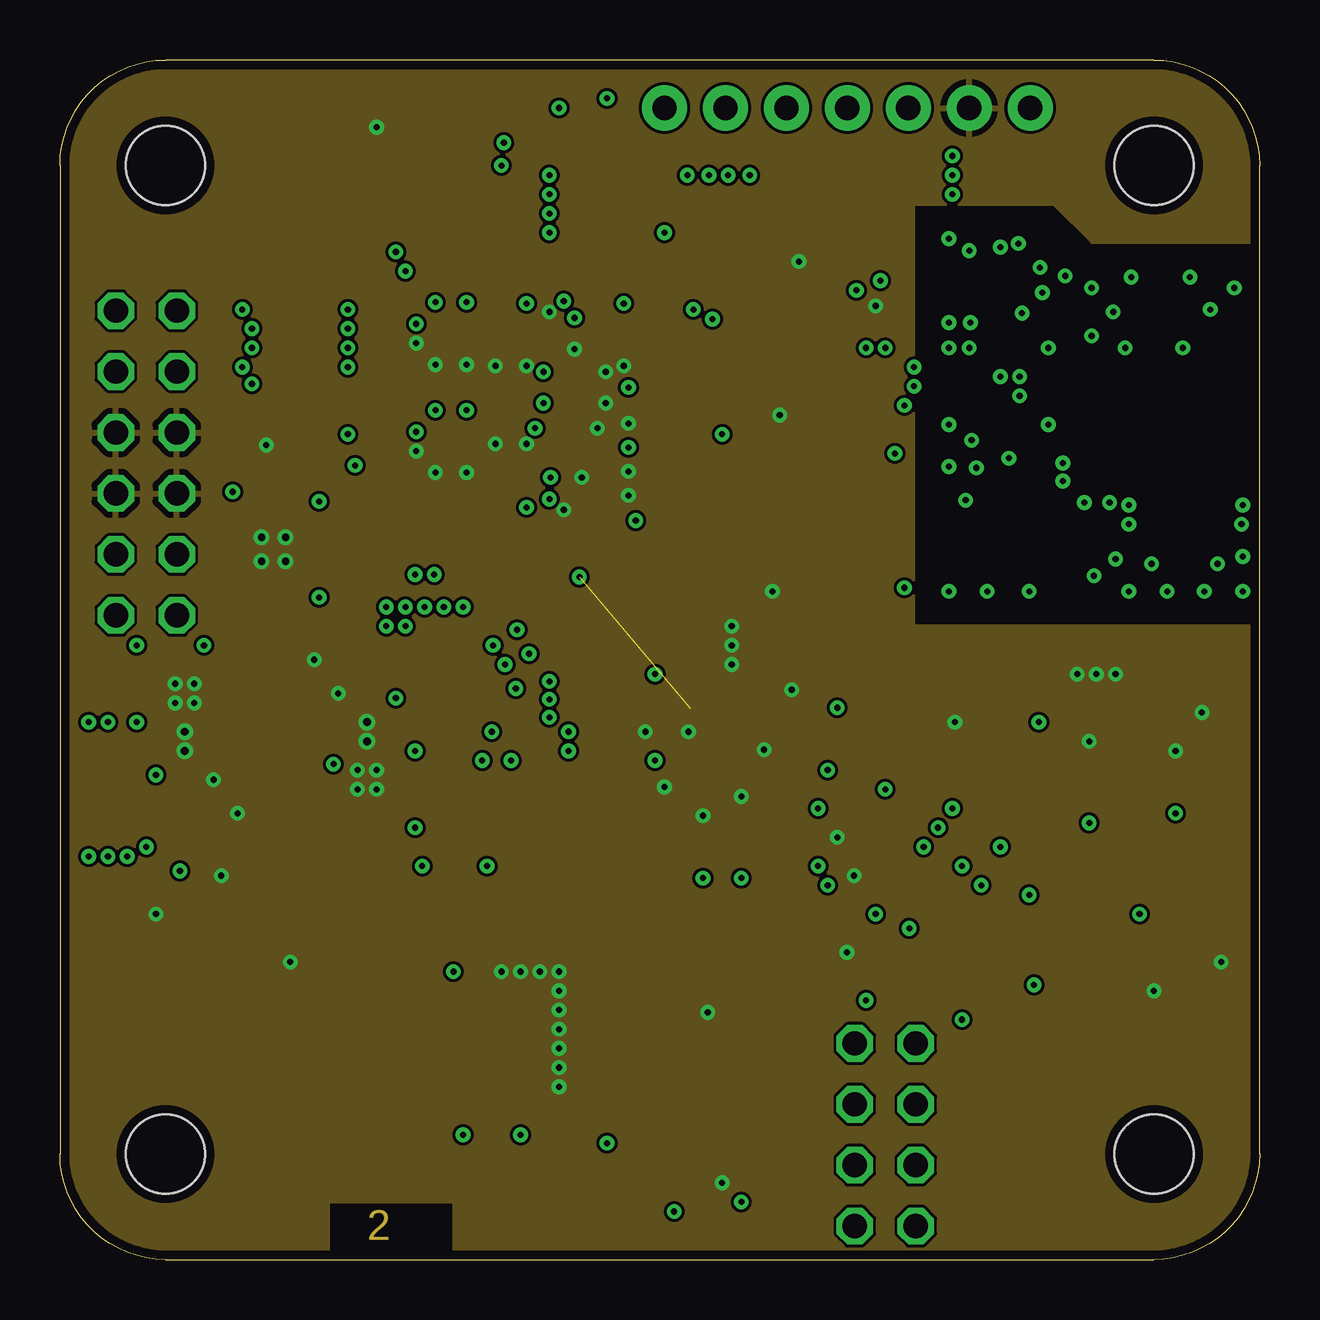
[diagram p4: board, inner layer Route2]
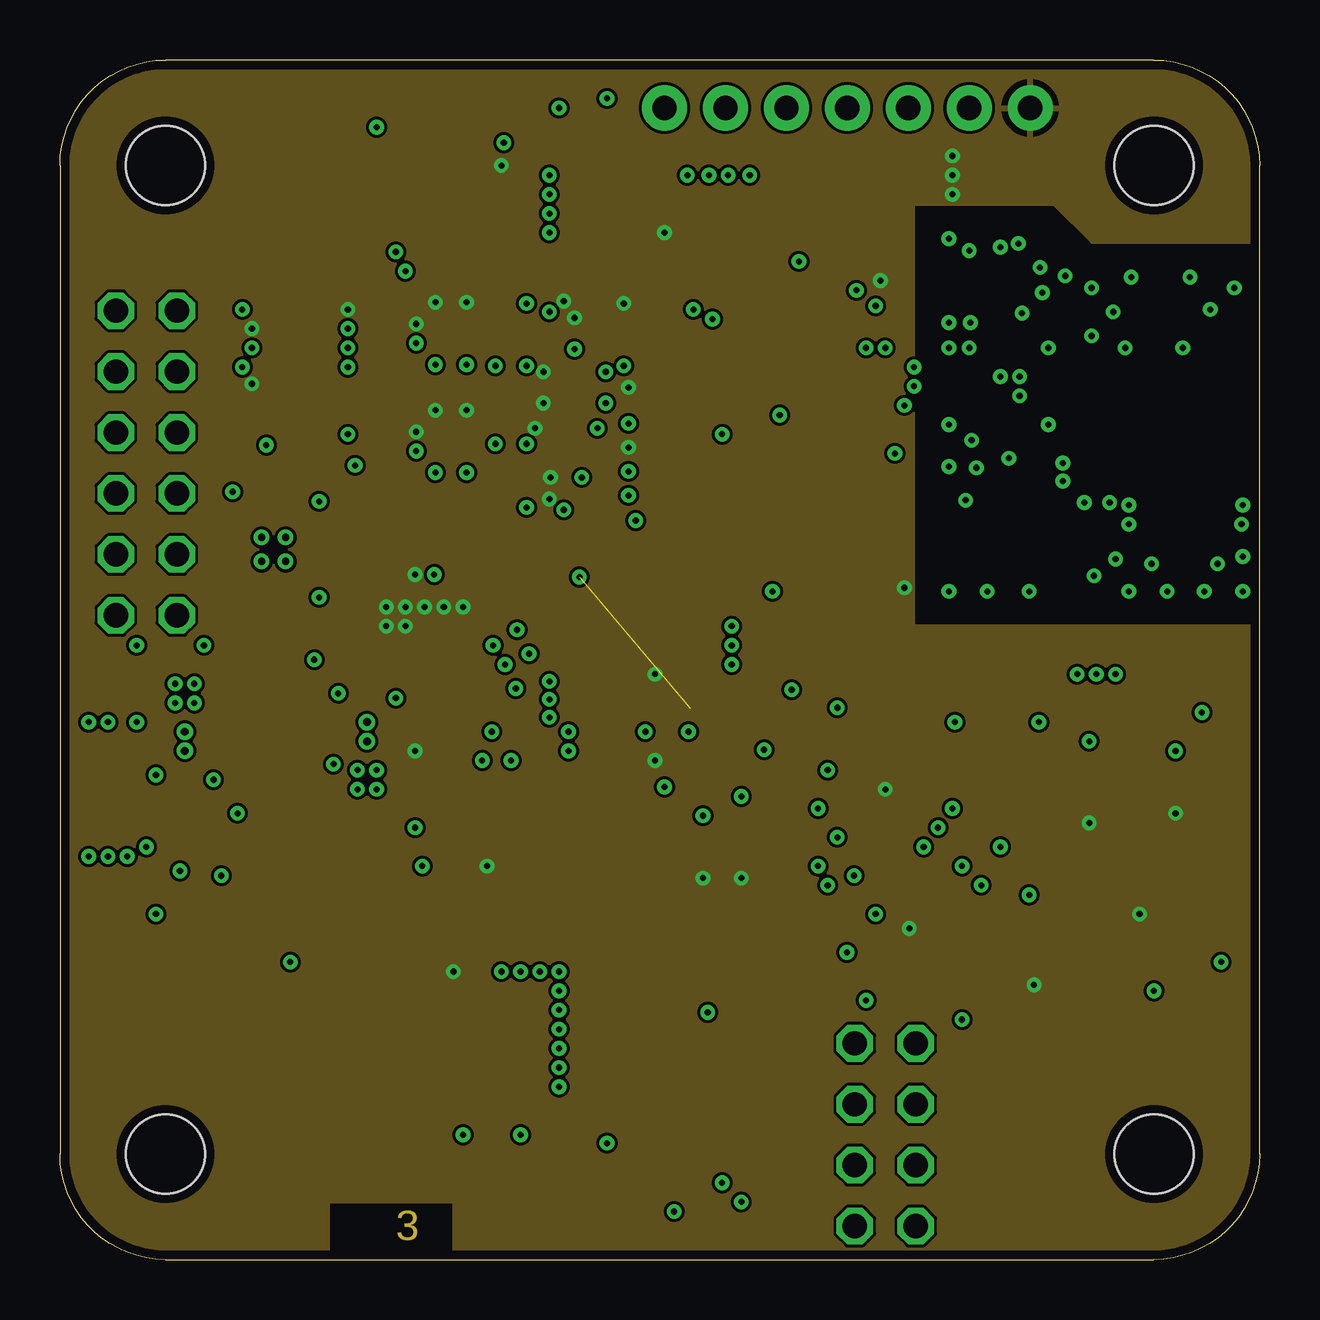
[diagram p5: board, inner layer Route3]
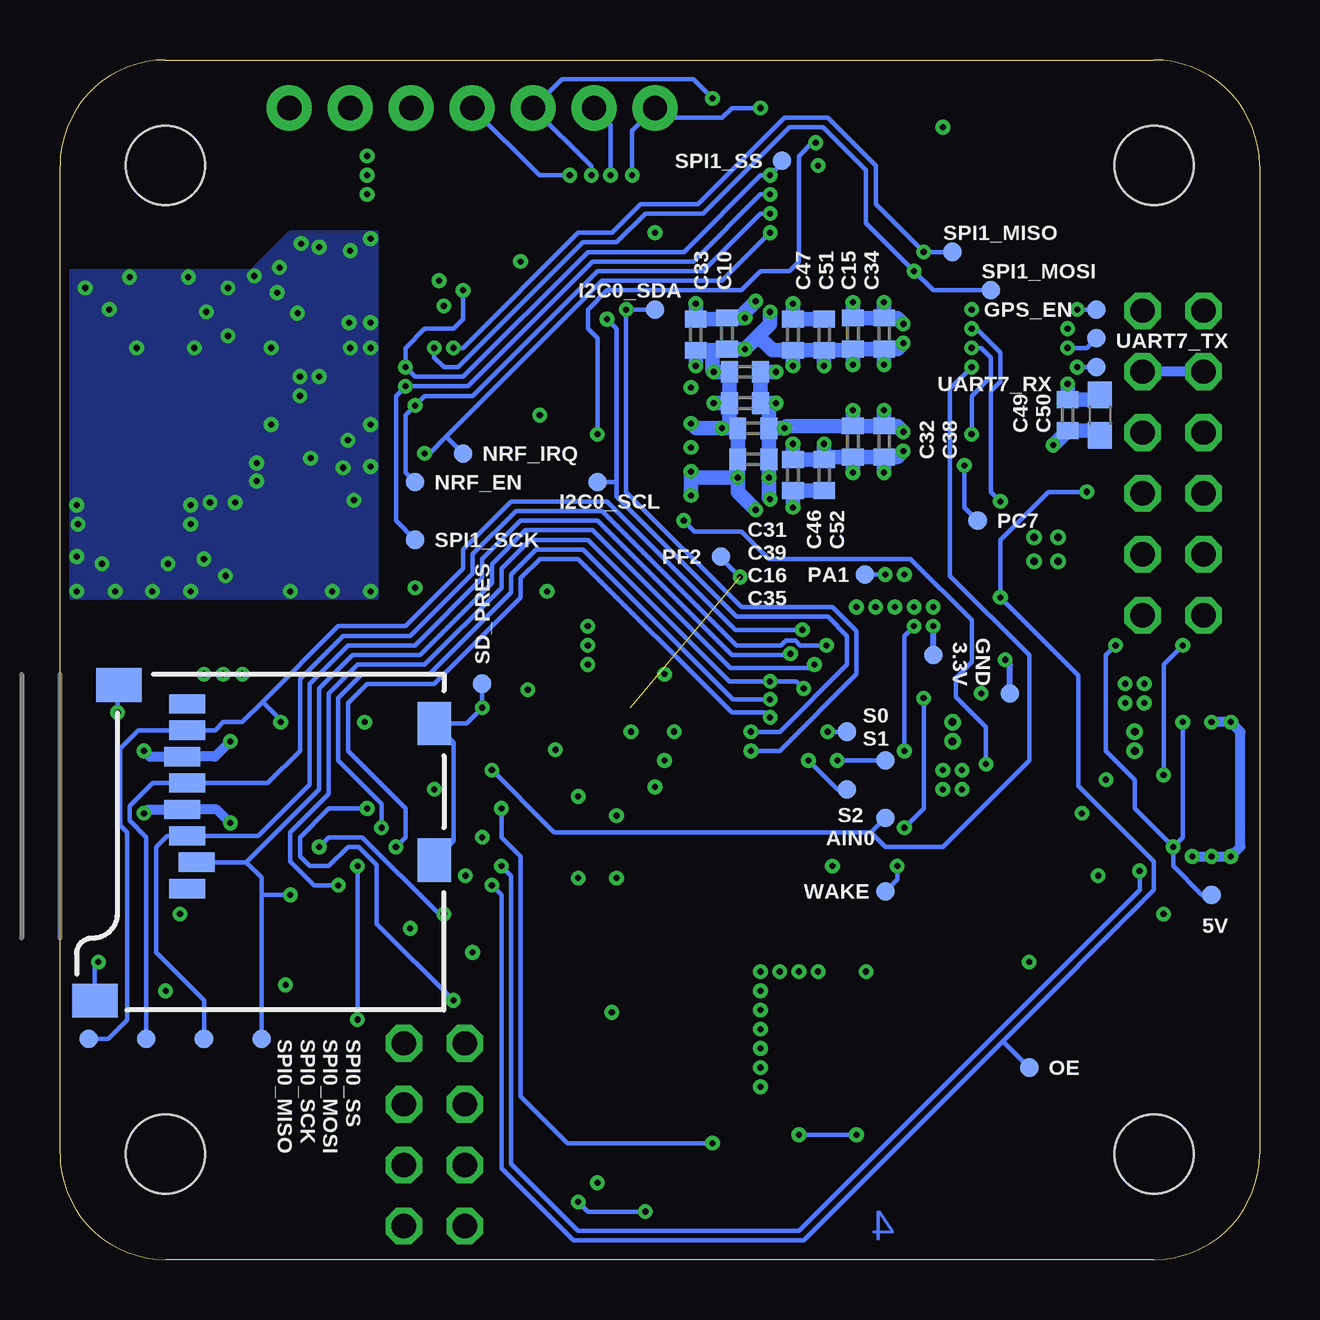
[diagram p6: board, bottom side, seen from below]

Size 50 x 50 mm. Coordinates in mm from the lower left corner, seen from the top.
Outline: 50,4.4 50,45.6 arc90 45.6,50 4.4,50 arc90 0,45.6 0,4.4 arc90 4.4,0 45.6,0 arc90 50,4.4
Copper layers (1+2*3+16): Top 0.035559375mm / dielectric 0.17018125mm / Route2 0.01778125mm / dielectric 47mil / Route3 0.01778125mm / dielectric 0.17018125mm / Bottom 0.035559375mm
Design rules "LaenPCBOrder4layer *": minimum track width 5mil, minimum drill 10mil, track to track 5mil, track to pad 5mil, pad to pad 5mil, via to via 5mil, smd to smd 5mil, copper to edge 15mil, drill to drill 5mil, minimum pad ring 7mil, minimum via ring 7mil, stop-mask expansion 4mil, vias tented up to drill 13mil, thermal gap 10mil
tRestrict: area 42,29.8 to 49.6,38.8

### Footprints (pad centres in the part's own frame; a part is rotated, then mirrored left to right if it is on the bottom)
C603 = smd 1.1 x 1: 1 -0.85,0; 2 0.85,0
C402 = smd 0.7 x 0.9: 1 -0.65,0; 2 0.65,0
C805 = smd 1.3 x 1.5: 1 -0.95,0; 2 0.95,0
0402-CAP = smd 0.7 x 0.9: 1 -0.65,0; 2 0.65,0
C1206 = smd 1.6 x 1.803: 1 -1.422,0; 2 1.422,0
PTC1812L = smd 1.7 x 3.15: 1 -2.62,0; 2 2.62,0
MSOP08 = smd 0.3 x 1.2: 1 -0.976,-2.113; 2 -0.326,-2.113; 3 0.324,-2.113; 4 0.974,-2.113; 5 0.974,2.112; 6 0.324,2.112; 7 -0.326,2.112; 8 -0.976,2.112
U.FL = smd 2.2 x 0.85: P$1 0,1.375; P$2 0,-1.375 | smd 1.05 x 1: P$3 1.525,0; P$4 -1.525,0
2X06 = drill 1.016 octagon: 1 -6.35,-1.27; 2 -6.35,1.27; 3 -3.81,-1.27; 4 -3.81,1.27; 5 -1.27,-1.27; 6 -1.27,1.27; 7 1.27,-1.27; 8 1.27,1.27; 9 3.81,-1.27; 10 3.81,1.27; 11 6.35,-1.27; 12 6.35,1.27
2X04 = drill 1.016 octagon: 1 -3.81,-1.27; 2 -3.81,1.27; 3 -1.27,-1.27; 4 -1.27,1.27; 5 1.27,-1.27; 6 1.27,1.27; 7 3.81,-1.27; 8 3.81,1.27
SJ_2S-NO = smd 0.635 x 1.27: 1 -0.45,0; 2 0.45,0
1X07 = drill 1.016 pad 1.88: 1 0,0; 2 2.54,0; 3 5.08,0; 4 7.62,0; 5 10.16,0; 6 12.7,0; 7 15.24,0
1210 = smd 1.2 x 2: 1 -1.6,0; 2 1.6,0
FB603 = smd 1.3 x 1.5: 1 -0.85,0; 2 0.85,0
C0402 = smd 0.7 x 0.9: 1 -0.65,0; 2 0.65,0
LED-603 = smd 0.8 x 0.8: A 0,-0.75; C 0,0.75
SOT-23 = smd 1 x 1.4: 1 -0.95,-1.1; 2 0.95,-1.1; 3 0,1.1
R402 = smd 0.7 x 0.9: 1 -0.65,0; 2 0.65,0
R603 = smd 1 x 1.1: 1 -0.85,0; 2 0.85,0
R1206 = smd 1.6 x 1.803: 1 -1.422,0; 2 1.422,0
0402-RES = smd 0.7 x 0.9: 1 -0.65,0; 2 0.65,0
RN8P-4R-CRA06S = smd 0.63 x 1.15: 1 -1.295,-0.975; 4 1.295,-0.975; 5 1.295,0.975; 8 -1.295,0.975 | smd 0.44 x 1.15: 2 -0.4,-0.975; 3 0.4,-0.975; 6 0.4,0.975; 7 -0.4,0.975
TACTILE_SWITCH_SMD = smd 1.524 x 0.762: 1 -2.54,1.905; 2 2.54,1.905; 3 -2.54,-1.905; 4 2.54,-1.905
PAD.03X.03 = smd 0.762 x 0.762: P$1 0,0
QFN-24-NP = smd 0.8 x 0.3: 1 -2,1.25; 2 -2,0.75; 3 -2,0.25; 4 -2,-0.25; 5 -2,-0.75; 6 -2,-1.25; 13 2,-1.25; 14 2,-0.75; 15 2,-0.25; 16 2,0.25; 17 2,0.75; 18 2,1.25 | smd 0.3 x 0.8: 7 -1.25,-2; 8 -0.75,-2; 9 -0.25,-2; 10 0.25,-2; 11 0.75,-2; 12 1.25,-2; 19 1.25,2; 20 0.75,2; 21 0.25,2; 22 -0.25,2; 23 -0.75,2; 24 -1.25,2
MICRO-SD-SOCKET-PP = smd 0.8 x 1.5: 1 -8.94,10.7; 2 -7.84,10.3; 3 -6.74,10.7; 4 -5.64,10.9; 5 -4.54,10.7; 6 -3.44,10.9; 7 -2.34,10.7; 8 -1.24,10.7 | smd 1.8 x 1.4: CD1 -2.05,0.4; CD2 -7.75,0.4 | smd 1.4 x 1.9: GND1 -13.6,14.55; GND3 -0.45,13.55
TSSOP-14 = smd 1.4 x 0.35: P$1 -2.875,1.95; P$2 -2.875,1.3; P$3 -2.875,0.65; P$4 -2.875,0; P$5 -2.875,-0.65; P$6 -2.875,-1.3; P$7 -2.875,-1.95; P$8 2.875,-1.95; P$9 2.875,-1.3; P$10 2.875,-0.65; P$11 2.875,0; P$12 2.875,0.65; P$13 2.875,1.3; P$14 2.875,1.95
S-PWSON-N8 = smd 0.28 x 0.5: 1 -0.75,-0.95; 2 -0.25,-0.95; 3 0.25,-0.95; 4 0.75,-0.95; 5 0.75,0.95; 6 0.25,0.95; 7 -0.25,0.95; 8 -0.75,0.95 | smd 1.6 x 0.9: PAD 0,0 | drill 0.33 pad 0.381: VIA1 -0.4,0; VIA2 0.4,0
MPLXXXXAX = smd 0.95 x 0.55: 1 -1,1.875; 2 -1,0.625; 3 -1,-0.625; 4 -1,-1.875; 5 1,-1.875; 6 1,-0.625; 7 1,0.625; 8 1,1.875
TI-PM = smd 0.3 x 1.6: P$1 -3.75,-5.6; P$2 -3.25,-5.6; P$3 -2.75,-5.6; P$4 -2.25,-5.6; P$5 -1.75,-5.6; P$6 -1.25,-5.6; P$7 -0.75,-5.6; P$8 -0.25,-5.6; P$9 0.25,-5.6; P$10 0.75,-5.6; P$11 1.25,-5.6; P$12 1.75,-5.6; P$13 2.25,-5.6; P$14 2.75,-5.6; P$15 3.25,-5.6; P$16 3.75,-5.6; P$33 3.75,5.6; P$34 3.25,5.6; P$35 2.75,5.6; P$36 2.25,5.6; P$37 1.75,5.6; P$38 1.25,5.6; P$39 0.75,5.6; P$40 0.25,5.6; P$41 -0.25,5.6; P$42 -0.75,5.6; P$43 -1.25,5.6; P$44 -1.75,5.6; P$45 -2.25,5.6; P$46 -2.75,5.6; P$47 -3.25,5.6; P$48 -3.75,5.6 | smd 1.6 x 0.3: P$17 5.6,-3.75; P$18 5.6,-3.25; P$19 5.6,-2.75; P$20 5.6,-2.25; P$21 5.6,-1.75; P$22 5.6,-1.25; P$23 5.6,-0.75; P$24 5.6,-0.25; P$25 5.6,0.25; P$26 5.6,0.75; P$27 5.6,1.25; P$28 5.6,1.75; P$29 5.6,2.25; P$30 5.6,2.75; P$31 5.6,3.25; P$32 5.6,3.75; P$49 -5.6,3.75; P$50 -5.6,3.25; P$51 -5.6,2.75; P$52 -5.6,2.25; P$53 -5.6,1.75; P$54 -5.6,1.25; P$55 -5.6,0.75; P$56 -5.6,0.25; P$57 -5.6,-0.25; P$58 -5.6,-0.75; P$59 -5.6,-1.25; P$60 -5.6,-1.75; P$61 -5.6,-2.25; P$62 -5.6,-2.75; P$63 -5.6,-3.25; P$64 -5.6,-3.75
JST-XH-4-SMD = smd 1.3 x 4.5: 1 -3.75,8.25; 2 -1.25,8.25; 3 1.25,8.25; 4 3.75,8.25 | smd 1.8 x 3.9: M1 -5.8,1.75; M2 5.8,1.75
TSX-3225 = smd 1.4 x 1.15: C1 -1.1,-0.8; C2 1.1,0.8; G1 -1.1,0.8; G2 1.1,-0.8
NXP-SOT763-1 = smd 0.9 x 0.24: 1 -1.8,-0.25; 8 1.8,-0.25; 9 1.8,0.25; 16 -1.8,0.25 | smd 0.24 x 0.9: 2 -1.25,-1.3; 3 -0.75,-1.3; 4 -0.25,-1.3; 5 0.25,-1.3; 6 0.75,-1.3; 7 1.25,-1.3; 10 1.25,1.3; 11 0.75,1.3; 12 0.25,1.3; 13 -0.25,1.3; 14 -0.75,1.3; 15 -1.25,1.3 | smd 1.9 x 0.9: PAD 0,0
SOT-23-6 = smd 0.65 x 1.06: 1 -0.95,-1.1; 2 0,-1.1; 3 0.95,-1.1; 4 0.95,1.1; 5 0,1.1; 6 -0.95,1.1
JST-SH-6-SMD-T = smd 0.6 x 1.55: 1 -2.5,-1.775; 2 -1.5,-1.775; 3 -0.5,-1.775; 4 0.5,-1.775; 5 1.5,-1.775; 6 2.5,-1.775 | smd 1.2 x 1.8: M1 -3.8,0.75; M2 3.8,0.75
QFN-20-4X4-0.5 = smd 0.84 x 0.25: P$1 -2,1; P$2 -2,0.5; P$3 -2,0; P$4 -2,-0.5; P$5 -2,-1; P$11 2,-1; P$12 2,-0.5; P$13 2,0; P$14 2,0.5; P$15 2,1 | smd 0.25 x 0.84: P$6 -1,-2; P$7 -0.5,-2; P$8 0,-2; P$9 0.5,-2; P$10 1,-2; P$16 1,2; P$17 0.5,2; P$18 0,2; P$19 -0.5,2; P$20 -1,2
CRYSTAL-WATCH-SMD = smd 1.1 x 0.6: 1 5.55,-0.45; 2 5.55,0.45 | smd 2.4 x 1.5: BODY 0,0
TI-RGY = smd 0.85 x 0.28: 1 -1.725,-0.75; 7 1.725,-0.75; 8 1.725,0.75; 14 -1.725,0.75 | smd 0.28 x 0.85: 2 -1,-1.725; 3 -0.5,-1.725; 4 0,-1.725; 5 0.5,-1.725; 6 1,-1.725; 9 1,1.725; 10 0.5,1.725; 11 0,1.725; 12 -0.5,1.725; 13 -1,1.725 | smd 2.05 x 2.05: PAD 0,0 | drill 0.3: V1 -0.5,-0.5; V2 0.5,-0.5; V3 0.5,0.5; V4 -0.5,0.5
3,3 = hole 3.3: 0,0

### Placement (x,y rotation side)
C1  28.4,17.6 90 top
C2  26.8,17.2 90 top
C3  25.2,18.4 90 top
C4  46.5,19.9 90 top
C5  37.95,2.65 270 top
C6  37.95,7.75 90 top
C7  30.85,2.65 90 top
C8  30.85,7.75 270 top
C9  29.2,23.75 0 top
C10  22.2,38.6 270 bottom
C11  28,21.25 0 top
C12  28.4,27.85 0 top
C13  10,22.8 90 top
C14  12.8,24.8 0 top
C15  16.95,38.6 270 bottom
C16  21.1,34.65 180 bottom
C17  32.8,31.2 270 top
C18  32.8,28.8 90 top
C19  37.75,30.1 90 top
C20  42.95,30.1 270 top
C21  42.7,33.1 270 top
C22  43.75,33.1 270 top
C23  48.3,36.9 0 top
C24  12.8,16.4 90 top
C25  48.95,38.95 90 top
C26  37.25,40.5 90 top
C27  8,20.8 270 top
C28  5.2,18.8 180 top
C29  36,22.4 0 top
C30  39.3,40.3 0 top
C31  21.45,37 180 bottom
C32  16.95,34.1 270 bottom
C33  23.5,38.55 270 bottom
C34  15.65,38.6 270 bottom
C35  21.1,33.35 180 bottom
C36  34.4,16 180 top
C37  22.4,8.9 180 top
C38  15.65,34.1 270 bottom
C39  21.45,35.7 180 bottom
C40  30.4,36 0 top
C41  30.4,40.8 180 top
C42  16.8,46.8 180 top
C43  39.3,41.35 0 top
C44  8.8,26 270 top
C45  7.6,26 270 top
C46  19.45,32.7 90 bottom
C47  19.45,38.55 270 bottom
C48  42.9,19.9 90 top
C49  8,35.2 270 bottom
C50  6.65,35.2 270 bottom
C51  18.15,38.55 270 bottom
C52  18.15,32.7 90 bottom
F1  4.8,11.2 180 top
IC2  24.8,6.8 0 top
J1  46.9,30.65 90 top
JP1  3.6,33.2 90 top
JP2  34.4,5.2 90 top
JP3  1.6,24 270 top
JP5  25.2,48 0 top
L1  16,24 90 top
L2  43.2,26.4 90 top
L3  43.2,36.15 90 top
L4  44.8,34.85 90 top
L5  45.25,36.9 0 top
L6  2,19.6 270 top
L7  39.2,45.2 0 top
LED1  14.4,12.4 90 top
LED2  2,15.2 270 top
LED3  42.8,12.8 90 top
LED4  31.7,44.1 90 top
Q1  42.8,15.6 0 top
Q2  34,42.8 0 top
R1  14.8,19.6 270 top
R2  24.8,11.5 0 top
R3  27,11.5 180 top
R4  27.2,7.9 90 top
R5  16.8,44.4 180 top
R6  11.6,12.4 180 top
R7  22.4,14.4 90 top
R8  21.2,14.4 90 top
R9  3.2,24 90 top
R10  24.8,10.4 180 top
R11  27.2,5.7 270 top
R12  25.9,3.2 180 top
R13  23.7,2.05 0 top
R14  23.7,3.2 180 top
R15  23.7,0.9 180 top
R16  25.9,0.9 180 top
R17  10,18.4 270 top
R18  2,14 0 top
R19  32.8,26.8 0 top
R20  42.8,11.2 0 top
R21  42.35,39.5 180 top
R22  40.35,32.5 0 top
R23  40.6,12.8 270 top
R24  16.8,45.6 0 top
R25  19.2,48 180 top
R26  20.1,46.65 180 top
R27  42.4,22.8 0 top
R28  12.75,40.7 180 top
R29  35.6,39.2 270 top
R30  14.05,29.2 270 top
R31  31,42.8 0 top
R32  16.45,16.4 180 top
RN1  27.45,43.2 180 top
RN2  23,44.4 180 top
S1  12,45.2 180 top
SJ1  16.8,48.4 180 top
TP1  46.4,9.2 0 bottom
TP2  41.6,9.2 0 bottom
TP3  48.8,9.2 0 bottom
TP4  44,9.2 0 bottom
TP5  27.6,32.4 0 bottom
TP6  25.2,39.6 0 bottom
TP7  35.2,30 0 bottom
TP8  19.9,45.8 0 bottom
TP9  12.8,42 0 bottom
TP10  17.2,19.6 0 bottom
TP11  15.6,18.4 0 bottom
TP12  15.6,20.8 0 bottom
TP13  17.2,22 0 bottom
TP14  2,15.2 0 bottom
TP15  13.6,25.2 0 bottom
TP16  10.4,23.6 0 bottom
TP17  11.2,40.4 0 bottom
TP18  33.2,33.6 0 bottom
TP19  35.2,32.4 0 bottom
TP20  32.4,24 0 bottom
TP21  6.8,39.6 0 bottom
TP22  6.8,38.4 0 bottom
TP23  6.8,37.2 0 bottom
TP24  9.6,8 0 bottom
TP25  16.45,28.55 0 bottom
TP26  15.6,15.35 0 bottom
TP27  11.75,30.8 0 bottom
TP29  22.45,29.3 0 bottom
U1  25,25 0 top
U2  34,24.4 90 bottom
U$1  34.4,12.8 180 top
U$2  12.8,22 270 top
U$3  22.4,18.4 180 top
U$4  5.2,21.6 90 top
U$5  19.2,35.6 270 top
U$6  15.45,0.6 0 top
U$7  30.4,38.4 90 top
U$8  34.4,19.6 270 top
U$9  7.2,16 0 top
U$10  8,37.2 90 top
U$11  39.6,36.4 0 top
U$12  26,30 0 top
U$13  40.35,30.1 0 top
U$18  8.9,29.6 90 top
U$19  [3,3]  4.4,4.4 0 top
U$20  [3,3]  4.4,45.6 0 top
U$21  [3,3]  45.6,45.6 0 top
U$22  [3,3]  45.6,4.4 0 top

### Tracks (layer width: path | path; a pad name or v marks a point on that pad's centre or on a via)
3.3V  (via drill 0.25)
  Top 0.178: U$8.16 34.65,19.6 U$8.PAD | R1.1 v14.8,21.2 14.25,21.75 U$2.6 | RN1.7 RN1.6 RN1.5 25.77,42.23 v25.2,42.8 | RN1.7 RN1.8 | 27.45,42.23 RN1.7 | v16.4,12 15.55,12 LED1.A | R24.2 v18.4,45.6 18.8,45.6 19.45,46.25 R26.2 | R30.2 v14.8,28.55 | R23.2 v40.6,11.45 | R19.2 34,26.8 v35.2,28 | R27.2 43.6,22.8 44,22.4 44,19.2 43.85,19.05 C48.1 | U$3.4 24.02,20.27 24.55,20.8 v24.8,20.8 | R8.1 R7.1 22.95,13.75 23.4,14.2 U$3.1 | Q2.2 34.95,41.55 v34.2,40.8 | Q1.2 43.85,14.4 v45,14.4 | R32.1 v17.8,16.4 | v13.6,27.2 13.05,26.65 9.35,26.65 | R28.2 12.1,39.7 v12,39.6 | U$10.5 9.68,38.8 v8,38.8
  Top 0.254: U$1.P$4 36.4,12.8 v35.4,13.8 35.05,14.15 C36.1 | U$8.16 34.65,22.25 34.8,22.4 C29.1 | C9.1 U1.13 25.45,23.75 v24.8,24.4 | v24.8,24.4 23.95,25.25 U1.3 | U1.8 24.25,23.85 v24.8,24.4
  Top 0.3: U$18.1 9.65,26.95 9.35,26.65 C44.1 | U$5.P$2 14.7,38.85 v14.85,39 | U$5.P$11 14.7,34.35 v14.85,34.5 | U$5.P$37 v23.7,33.85 | U$5.P$42 v23.7,36.35 | U$5.P$26 19.95,31.05 20.4,31.5 v20.4,31.7 | U$5.P$54 20.45,40.3 20.8,39.95 v21,39.95
  Top 0.406: 28.35,16.75 C1.1 | U$3.1 26.77,16.52 C2.1
  Top 0.6: C4.1 v46.5,18.6 | v26.8,15.9 C2.1 28.2,16.55 C1.1 v28.4,15.9 | C48.1 v42.9,18.2 | U$10.2 8.8,35.7 v8,36.5
  Bottom 0.178: v14.8,21.2 14.8,26 v14.4,26.4
  Bottom 0.254: TP15.P$1 v13.6,26.4
  Bottom 0.406: U2.4 | U2.4 43.46,18.76 v42.9,18.2 | U2.4 46.34,18.76 v46.5,18.6
  Bottom 0.6: C16.1 C35.1 v20.45,32.6 20.45,31.75 v20.4,31.7 | C16.1 v19.8,34.65 19.7,34.75 C32.1 | C34.1 C15.1 v16.95,39.9 | v15.65,39.9 C34.1 | v20.15,37 C31.1 C39.1 | v23.5,39.85 C33.1 22.25,39.2 C10.1 v21.45,39.25 21.45,39.5 v21,39.95 | v15.65,35.4 C38.1 | C32.1 C38.1 | v16.95,35.4 C32.1 | v14.85,34.5 15.1,34.75 C38.1 | v14.85,39 15.1,39.25 C34.1 | C39.1 20.45,35.35 C16.1 | v20.15,35.7 C39.1 | C50.1 6.85,35.85 C49.1 v8,36.5
  other vias: 34.4,19.6 14.4,27.2 15.2,27.2 16,27.2 16.8,27.2 37.2,46 37.2,45.2 37.2,44.4
  pour Top (no thermals): 13.1,24.05 13.1,27.6 16.8,27.6 17,27.4 17,25 15,25 15,24.65 14.4,24.05
  pour Top (no thermals): 38.95,44.15 38.95,46.25 36.95,46.25 36.95,44.15
  pour Route3: 0,0 11.2,0 11.2,2.4 16.4,2.4 16.4,0 50,0 50,26.4 35.6,26.4 35.6,44 41.4,44 43,42.4 50,42.4 50,50 0,50
+5V  (via drill 0.25)
  Top 0.178: U$4.6 3.75,21.85 v3.2,22.4 R9.1 | LED2.A 1.25,16.75 v1.2,16.8 | C45.1 7.05,26.65 v6,25.6
  Top 0.3: U$18.14 8.15,27.35 7.6,26.8 C45.1
  Top 0.406: v2,22.4 v1.2,22.4 1.6,22.4 JP3.2
  Bottom 0.178: v3.2,22.4 3.2,17.6 v3.6,17.2 | v3.6,17.2 3.6,16.4 2.4,15.2 TP14.P$1 | v6,25.6 6.4,25.2 6.4,21.2 5.2,20 5.2,18.8 v3.6,17.2
  Bottom 0.406: v2.8,16.8 v1.2,16.8 0.8,17.2 0.8,22 v1.2,22.4 v2,22.4
  other vias: 2,16.8
  pour Top (no thermals): 4.9,19.55 4.9,17.3 3.6,16 1.2,16 1,16.2 1,18.6 3,18.6 3,18.95 3.6,19.55
AGND  (via drill 0.25)
  Top 0.178: U$11.P$14 40,36.9 v40,36.8
  Top 0.203: U$11.P$17 40.1,40.15 C30.2 C43.2
  Top 0.23: U$11.P$8 39.6,35.2
  other vias: 39.2,36.8 40,36 37.05,42.55 37.9,42.05 39.2,42.2 39.95,42.35 40.85,41.35 41.9,41 40.95,40.3 41.2,38 37.95,39.05 37.9,38 37.05,38 37.05,39.05 43,38.5 43.9,39.5 43,40.5 44.65,40.95 44.4,38 46.8,38 47.1,40.95 47.95,39.6 48.95,40.5 37.05,34.8 38,34.15 39.55,33.4 38.2,33 37.05,33.05 37.75,31.65 44.55,30.65 44,29.2 44.55,27.85 43.1,28.5 40.4,27.85 38.65,27.85 37.05,27.85 49.3,29.3 49.3,31.45 48.25,29 41.2,34.8 41.8,33.2 41.8,32.45 42.7,31.55 49.3,27.85 45.5,29 46.15,27.85 47.7,27.85 43.75,31.55 44.55,31.45 49.25,30.65 40.1,39.45
  pour Top: 38.4,35.2 40.8,35.2 40.8,37.6 38.4,37.6
  pour Top: 49.6,27.6 36.8,27.6 36.8,42.8 40.4,42.8 42,41.2 49.6,41.2
  pour Bottom: 49.6,27.6 36.8,27.6 36.8,42.8 40.4,42.8 42,41.2 49.6,41.2
AIN0  (via drill 0.25)
  Top 0.178: U$8.3 32.05,20.35 v32,20.4 | U$5.P$6 13.43,36.8 12.4,36.8 v12,37.2
  Bottom 0.178: v32,20.4 29.6,18 29.4,17.8 16.2,17.8 | 16.2,17.8 15.6,17.2 13.2,17.2 9.6,20.8 9.6,25.2 12.9,28.5 12.9,36.3 v12,37.2 | TP11.P$1 16.2,17.8
CELL1  (via drill 0.25)
  Top 0.178: R4.1 R11.1 22.75,6.35 21.6,5.2 v19.2,5.2 | U$6.2 14.2,6.4 15.4,5.2 v16.8,5.2
  Bottom 0.178: v16.8,5.2 v19.2,5.2
CELL2
  Top 0.178: R15.2 R13.1 22.45,2.65 22.45,4.35 22.25,4.55 18.55,4.55 16.7,6.4 U$6.3
CELLV1
  Top 0.178: IC2.7 24.47,10.08 | 24.47,10.08 R10.2 | 24.47,10.08 24.8,10.4 24.8,12 25.2,12.4 27.2,12.4 30,15.2 30,20.4 31.6,22 34.15,22 U$8.1
CELLV2  (via drill 0.25)
  Top 0.178: R14.2 23.05,3.91 IC2.1 22.91,4.69 22.8,4.8 v22.8,4.85 | U$8.5 32.15,19.35 v31.6,18.8
  Bottom 0.178: v22.8,4.85 28.85,4.85 30.8,6.8 30.8,16.8 31.6,17.6 v31.6,18.8
CELLV3  (via drill 0.25)
  Top 0.178: R15.1 R16.2 25.6,1.25 v25.6,2 | U$8.2 32.35,20.85 32,21.2 31.6,21.2 30.4,20 30.4,14.8 28.8,13.2 28.8,2.8 v28.4,2.4
  Bottom 0.178: v25.6,2 28,2 v28.4,2.4
ESC_POWER
  Top 0.406: JP3.1 0.8,25.25 0.8,29.39 | 0.8,29.39 0.8,35.48 JP1.10 | 0.8,29.39 JP1.4 JP1.3
  Bottom 0.406: JP1.10 JP1.9
GND  (via drill 0.25)
  Top 0.152: v4.8,23.2 4.25,22.65 U$4.5 | v13.2,20.4 13.75,20.95 U$2.5
  Top 0.178: v27,10.3 27.65,10.95 R3.1 | R12.1 26.55,3.91 IC2.4 | R12.1 v27.6,3.2 | R16.1 R12.1 | U$8.8 34.15,17.35 34,17.2 32.8,17.2 v32.4,17.6 32.4,18.15 32.6,18.35 U$8.7 | 23.4,19.05 U$3.3 | U$7.G1 29.6,36.15 C40.1 29.75,35.45 v30,35.2 | U$7.G2 31.2,40.65 C41.1 31.05,41.35 v30.8,41.6 | U1.11 25.75,22.45 v26.2,22 | U1.1 U1.18 | C42.2 15.85,47.1 S1.3 13.29,47.1 v13.2,47.2 | R18.2 3.6,14 v4,14.4 | R6.2 v9.6,12.4 | C17.2 33.35,30 | C18.2 33.35,30 | U$5.P$35 33.15,32.85 33.6,32.4 33.6,30.25 33.35,30 | R20.2 v45.6,11.2 | R31.2 31.85,42.15 32,42 32,40.55 32.8,39.75 v34,39.75
  Top 0.203: R29.1 34.1,39.85 v34,39.75
  Top 0.254: v32.8,12.8 U$1.P$11 | U1.9 24.75,22.35 v24.4,22 | U1.15 28,24.75 v28,24.8 | U1.18 28,26.25 v28,26.4 | U1.17 27.85,25.75 v28,25.6
  Top 0.3: U$5.P$35 v23.7,32.85 | U$5.P$3 14.7,38.35 v14.85,38.2 | U$5.P$12 14.7,33.85 v14.85,33.7 | U$5.P$33 v23.7,31.85 | U$5.P$39 v23.7,34.85 | U$5.P$27 20.45,30.9 20.8,31.25 v21,31.25 | U$5.P$55 19.95,40.15 20.4,39.7 v20.4,39.5 | U$18.V4 8.4,29.6 U$18.PAD | U$18.V2 9.65,30.1 U$18.7
  Top 0.406: U$9.1 6.25,15.53 v6.72,16 7.2,15.53 U$9.2 | U$3.3 25.18,19.02 C3.2 | v10.6,25 10.25,25.35 C44.2 C45.2
  Top 0.6: C11.2 v29.35,21.25 | C9.2 v30.5,23.75 | C29.2 v37.3,22.4 | C36.2 v33.1,16 | v46.5,21.2 C4.2 | C2.2 v26.8,18.5 | v28.4,19.3 C1.2 26.85,18.45 v26.8,18.5 | v25.2,19.7 C3.2 | C12.2 v29.7,27.85 | C48.2 v42.9,21.6 | 25.18,19.02 26.27,19.02 v26.8,18.5 | U$10.1 9.35,34.7 v8.6,33.95
  Top 0.813: C37.2 20.8,8.9 v20.8,8.8
  Top 1.016: C24.2 12.8,20
  Bottom 0.178: U2.GND1 48.55,12.25 v48.4,12.4 | U2.GND3 47.6,23.9 v47.6,22.8
  Bottom 0.254: TP16.P$1 10.4,24.8 v10.6,25
  Bottom 0.406: v42.9,21.6 43.54,20.96 U2.6 46.26,20.96 v46.5,21.2
  Bottom 0.6: v21.75,32.6 C35.2 C16.2 | C16.2 v22.4,34.65 23.5,34.65 v23.7,34.85 | C15.2 C34.2 | v15.65,37.3 C34.2 | v16.95,37.3 C15.2 | v23.5,37.25 C33.2 22.8,37.9 | v22.75,35.7 C39.2 | v15.65,32.8 C38.2 | C32.2 C38.2 | v16.95,32.8 C32.2 | v19.45,34 C46.2 C52.2 | C47.2 v19.45,37.25 | C51.2 C47.2 | C52.2 v18.15,34 | v14.85,38.2 15.1,37.95 C34.2 | v14.85,33.7 15.1,33.45 C38.2 | v21,31.25 21.75,32 v21.75,32.6 | v23.7,31.85 v23.7,32.85 23.7,32.6 v21.75,32.6 | C32.2 18.15,33.45 C52.2 | C51.2 17,37.9 C15.2 | v18.15,37.25 C51.2 | C47.2 20.3,37.9 20.9,38.5 | C39.2 C31.2 v22.75,37 22.8,37.05 22.8,37.9 | 22.8,37.9 22.25,37.9 C10.2 v21.45,37.95 20.9,38.5 | v20.4,39.5 20.4,39 20.9,38.5 | C39.2 22.1,35 C16.2 | C50.2 6.85,34.55 C49.2 v8.6,33.95
  other vias: 5.6,23.2 5.6,24 4.8,24 12.4,20.4 13.2,19.6 12.4,19.6 18.4,12 19.2,12 20,12 20.8,12 20.8,11.2 20.8,10.4 20.8,9.6 20.8,8 20.8,7.2 7.4,18.6 6.4,20 11.6,23.6 42.4,24.4 43.2,24.4 44,24.4
  pour Top (no thermals): 6,24.4 6,22.8 5.55,22.8 5.55,22.4 6.3,22.4 6.3,22.3 5.55,22.3 5.55,20.9 6.4,20.9 6.8,20.5 8.75,20.5 8.75,19.2 7.6,18.05 5.5,18.05 5.5,20.2 4.85,20.85 4.85,22.8 4.4,22.8 4.4,24.4
  pour Top (no thermals): 12,19.2 12,20.8 12.45,20.8 12.45,21.2 11.7,21.2 11.7,21.3 12.45,21.3 12.45,22.7 11.6,22.7 11.2,23.1 9.25,23.1 9.25,24.4 10.4,25.55 12.5,25.55 12.5,23.4 13.15,22.75 13.15,20.8 13.6,20.8 13.6,19.2
  pour Top (no thermals): 18.55,6.6 20.6,6.6 21.1,7.1 21.1,12.1 20.95,12.25 20.9,12.3 18.4,12.3 18.3,12.3 18.1,12.1 18.1,11.55 18.55,11.1
  pour Top (no thermals): 42.15,26.15 44.25,26.15 44.25,24.15 42.15,24.15
  pour Route2: 0,0 11.2,0 11.2,2.4 16.4,2.4 16.4,0 50,0 50,26.4 35.6,26.4 35.6,44 41.4,44 43,42.4 50,42.4 50,50 0,50
GPS_EN  (via drill 0.25)
  Top 0.178: U$5.P$7 12.05,36.35 11.45,36.95 11.45,39.35 11.1,39.7 U$10.6 7.7,39.7 v7.6,39.6
  Bottom 0.178: v7.6,39.6 TP21.P$1
I2C0_SCL  (via drill 0.25)
  Top 0.178: U1.23 24.25,27.75 24,28 22.2,28 21.6,27.4 21.6,22.4 v21.2,22 19.45,20.25 19.45,17.75 20.68,16.52 U$3.8 21.4,15.8 21.2,15.6 R8.2 | v27.2,39.2 26.85,38.85 U$5.P$47
  Bottom 0.178: v21.2,22 20,22 17.2,24.8 17.2,26 18,26.8 21.8,26.8 26.8,31.8 26.8,32.4 | 26.8,32.4 26.8,38.8 v27.2,39.2 | TP5.P$1 26.8,32.4
I2C0_SDA  (via drill 0.25)
  Top 0.178: U1.24 23.75,27.45 23.6,27.6 22.4,27.6 22,27.2 22,22 v21.2,21.2 20.2,20.2 20.2,18.2 20.62,17.77 U$3.7 22.02,17.77 22.4,17.4 R7.2 | v26.4,39.6 26.15,39.35 U$5.P$48
  Bottom 0.178: v21.2,21.2 20,21.2 16.8,24.4 16.8,26.2 17.8,27.2 21.6,27.2 26.4,32 v26.4,39.6 TP6.P$1
LC  (via drill 0.25)
  Top 0.178: v31.6,16.4 30.8,17.2 30.8,19.2 31.45,19.85 U$8.4 | U$9.6 5.9,17.1 v5,16.2
  Bottom 0.178: v31.6,16.4 31.2,16 31.2,4 28.4,1.2 19.2,1.2 5,15.4 v5,16.2
LOGIC
  Top 0.152: 10.1,21.75 C13.1 | 7.9,21.85 C27.1
  Top 0.178: R17.1 8.08,17.9 7.55,17.9 7.2,17.55 U$9.5 | U$2.3 10.1,21.75 | U$4.3 7.9,21.85
  Top 1.016: R17.1 C13.1 8.1,21.85 C27.1
  pour Top (no thermals): 9.25,21.2 9.25,22.5 11.1,22.5 11.3,22.3 12,22.3 12,22.2 11,22.2 10.75,21.95 10.75,21.2
  pour Top (no thermals): 8.75,22.4 8.75,21.1 6.9,21.1 6.7,21.3 6,21.3 6,21.4 7,21.4 7.25,21.65 7.25,22.4
M0_PWM0  (via drill 0.25)
  Top 0.178: U$5.P$1 12.55,39.35 v12,38.8 | U$18.5 11.1,30.1 11.35,30.35 11.35,31.45 11.2,31.6 v10.8,31.6
  Bottom 0.178: v12,38.8 11.8,38.8 10.8,37.8 10.8,36.6 11.2,36.2 11.2,32 v10.8,31.6
M0_PWM1  (via drill 0.25)
  Top 0.178: U$5.P$4 12.15,37.85 v12,38 | U$18.4 11.15,29.6 11.75,30.2 11.75,34.15 v12,34.4
  Bottom 0.178: v12,38 11.6,38 11.2,37.6 11.2,36.8 12,36 v12,34.4
M0_PWM6
  Top 0.178: U$18.2 11.25,28.6 13.6,30.95 U$5.P$16
M0_PWM7
  Top 0.178: U$18.3 11.2,29.1 12.15,30.05 12.15,31.85 12.65,32.35 U$5.P$15
MC1  (via drill 0.25)
  Top 0.178: U$8.13 37.75,19.85 38,19.6 38,16.8 v37.6,16.4 | U$1.P$1 37.27,10.32 v37.6,10
  Bottom 0.178: v37.6,10 v37.6,16.4
MC2
  Top 0.178: U$8.14 38.05,20.35 38.4,20 38.4,16.8 39.2,16 39.2,15.2 38.75,14.75 U$1.P$7
MC3  (via drill 0.25)
  Top 0.178: U$8.15 38.35,20.85 39.2,20 v39.2,17.2 | U$1.P$8 33.65,14.75 v34,14.4
  Bottom 0.178: v34,14.4 34.2,14.4 37.4,17.6 38.8,17.6 v39.2,17.2
MC4  (via drill 0.25)
  Top 0.178: U$8.12 36.65,19.35 v37.2,18.8 | v33.6,10.8 31.57,10.8 U$1.P$14
  Bottom 0.178: v37.2,18.8 38.8,18.8 40,17.6 40,16.8 39.6,16.4 38.8,16.4 38,17.2 37.55,17.2 36.8,16.45 36.8,14 v33.6,10.8
MPU_INT  (via drill 0.25)  (1 unrouted)
  Top 0.178: U$5.P$30 21.95,28.75 v21.65,28.45
  Bottom 0.178: v21.65,28.45 22.45,29.25 TP29.P$1
N$2
  Top 0.178: LED1.C R6.1
N$3
  Top 0.254: U1.20 25.75,27.55 26.05,27.85 C12.1
N$4
  Top 0.254: C11.1 25.9,21.25 25.25,21.9 U1.10
N$5
  Top 0.178: R5.2 15.64,44.4 S1.1
N$6
  Top 0.178: IC2.5 25.77,9.57 26.05,9.85 26.05,11.5 R3.2 R2.2
N$7
  pour Top (no thermals): 17,23 17,21.8 15,21.8 14.6,22.2 13.6,22.2 13.6,22.3 14.3,22.3 15,23
N$8
  Top 0.178: U$12.2 31.55,31.15 32.25,31.85 | 32.25,31.85 C17.1 | U$5.P$34 31.75,32.35 32.25,31.85
N$9  (via drill 0.25)
  Top 0.178: R1.2 v14.8,18 | v14,23.4 13.75,23.15 U$2.8
  Bottom 0.178: v14.8,18 14,18.8 v14,23.4
N$10
  Top 0.178: R10.1 25.12,10.07 IC2.6 25.12,8.28 25.35,8.05 26.7,8.05 R4.2
N$11
  Top 0.178: U$12.1 31.55,28.85 32.25,28.15 C18.1 33.35,28.15 34,28.8 34,32.8 33.45,33.35 U$5.P$36
N$12
  Top 0.178: LED2.C 2,15.2 2,14 R18.1
N$13
  Top 0.178: Q1.3 42.8,13.55 LED3.A
N$14
  Top 0.178: LED3.C 41.95,12.7 R20.1
N$15
  Top 0.178: R22.1 40.1,32.9 U$11.P$9
  Top 0.203: C19.1 37.9,29.3 U$13.C1 40.1,29.3 40.4,29.6 40.4,31.6 39.7,32.3 R22.1
N$16
  pour Top (no thermals): 1,20.6 1,21.8 3,21.8 3.4,21.4 4.4,21.4 4.4,21.3 3.7,21.3 3,20.6
N$17
  Top 0.178: R22.2 40.6,32.9 U$11.P$10
  Top 0.203: C20.1 42.8,30.9 U$13.C2 41,31.35 R22.2
N$18
  Top 0.178: LED4.C 30.15,43.3 R31.1
N$19  (via drill 0.25)
  Top 0.178: R9.2 v3.2,25.6 | v4,20.2 4.25,20.45 U$4.8
  Bottom 0.178: v3.2,25.6 4,24.8 v4,20.2
N$20
  Top 1.016: U$6.1 9.35,11.2 F1.1
N$21
  Top 0.406: U$3.2 25.18,17.77 C3.1
N$22
  Top 0.61: C23.2 C25.1 | C23.2 48.98,36.9 | C23.2 48.95,35.35 arc-90 48,34.4 arc90 46.9,33.3 J1.P$3
N$23
  Top 0.203: U$11.P$19 39.1,39 38.5,39.6 37.5,39.6 C26.1
N$24
  Top 0.178: R12.2 25.12,3.33 IC2.3 25.12,5.32 25.35,5.55 26.7,5.55 R11.2
N$25
  Top 0.178: IC2.2 24.47,3.32 R14.1 R13.2
N$26
  Top 0.23: U$11.P$12 42.8,35.9 L3.1
  Top 0.61: L3.1 L4.2
N$27
  Top 0.178: U$7.C1 31.2,36.15 C40.2 31.05,35.05 30.4,34.4 28.8,34.4 27.85,35.35 U$5.P$40
N$28
  Top 0.23: U$11.P$13 42.8,36.4 L3.2
  Top 0.61: L3.2 44.5,36.8 L5.1
N$29
  Top 0.61: L5.2 C23.1
N$30
  Top 0.178: U$7.C2 29.6,40.65 C41.2 28.8,40.8 28.4,40.4 28.4,36.4 27.85,35.85 U$5.P$41
N$31
  Top 0.178: U$11.P$16 40.6,38.95 41.15,39.5 R21.2
N$32
  Top 0.178: Q2.3 33.8,44.1 LED4.A
N$34
  Top 0.178: JP5.5 33.13,45.77 24.7,45.77 RN2.1
N$35  (via drill 0.25)
  Top 0.178: JP5.4 31.62,46.8 24,46.8 23.4,46.2 RN2.2 | RN1.1 v28.75,45.2
  Bottom 0.178: JP5.4 30.02,45.2 v28.75,45.2
N$37  (via drill 0.25)
  Top 0.178: RN1.2 v27.85,45.2 | v22.8,48.4 22.6,48.2 RN2.3
  Bottom 0.178: v22.8,48.4 23.6,49.2 29.08,49.2 JP5.3 27.85,45.57 v27.85,45.2
N$38  (via drill 0.25)
  Top 0.178: JP5.2 26.54,49.2 22.4,49.2 21.7,48.51 RN2.4 | v27.05,45.2 RN1.3
  Bottom 0.178: JP5.2 27.05,47.31 v27.05,45.2
N$39  (via drill 0.25)
  Top 0.178: RN1.4 v26.15,45.2 | R25.1 v20.8,48
  Bottom 0.178: v20.8,48 22,48 22.4,47.6 24.8,47.6 JP5.1 26.15,47.05 v26.15,45.2
NRF_EN  (via drill 0.25)
  Top 0.178: U$5.P$60 17.45,42.2 18.05,42.8 19.2,42.8 20,43.6 v20.4,43.6 | U$11.P$1 36.4,37.4 36,37.8 35.6,37.8 | v35.2,35.6 34.95,35.85 34.95,37.55 35.2,37.8 35.6,37.8 | R29.2 35.6,37.8
  Bottom 0.178: v20.4,43.6 20.8,43.6 23.2,41.2 27.6,41.2 32.8,36 34.8,36 v35.2,35.6 35.6,35.2 35.6,32.8 TP19.P$1
NRF_IRQ  (via drill 0.25)
  Top 0.178: U$5.P$59 17.95,42.1 18.25,42.4 20,42.4 v20.4,42.8 | U$11.P$6 38.6,33.8 38.4,33.6 v34.8,33.6
  Bottom 0.178: v20.4,42.8 22.4,40.8 27.4,40.8 33.9,34.3 | 33.9,34.3 34.6,33.6 v34.8,33.6 | TP18.P$1 33.9,34.3
OE  (via drill 0.25)
  Top 0.178: U$8.6 32.55,18.85 31.6,17.9 31.6,17.4 32.4,16.6 32.4,16 v32,15.6 | U$18.8 8.15,31.85 8,32 v7.2,32 | v10.8,27.6 13.05,29.85 R30.1 15.3,29.85 U$5.P$17
  Bottom 0.178: v32,15.6 31.6,15.2 31.6,3.8 28.6,0.8 19,0.8 10.7,9.1 | 10.7,9.1 4.4,15.4 4.4,16.6 7.55,19.75 7.55,24.35 v10.8,27.6 10.8,30 8.8,32 v7.2,32 | TP24.P$1 10.7,9.1
PA1  (via drill 0.25)
  Top 0.178: U$5.P$18 15.95,28.9 v15.6,28.55
  Bottom 0.178: TP25.P$1 v15.6,28.55
PC7  (via drill 0.25)
  Top 0.178: U$5.P$13 12.55,33.35 v12.3,33.1
  Bottom 0.178: v12.3,33.1 12.3,31.35 TP27.P$1
PWM0
  Top 0.178: U$18.10 6.7,30.1 6,30.8 4,30.8 3.8,31 3.8,38.48 JP1.11
PWM1
  Top 0.178: U$18.11 6.4,29.6 5.6,30.4 3.6,30.4 3.4,30.6 3.4,38.48 JP1.12
PWM2
  Top 0.178: U$18.13 6.62,28.6 JP1.1
PWM3
  Top 0.178: U$18.12 6.3,29.1 5.2,28 3.48,28 JP1.2
RS1+
  Top 0.178: U$1.P$3 38.25,12.15 38.8,11.6 38.8,7.6 38.4,7.2 38.05,7.2 C6.1 37.32,6.47 JP2.5
RS1-
  Top 0.178: U$1.P$2 38.1,11.5 38.4,11.2 38.4,8.85 C6.2 37.34,9.01 JP2.7
RS2+
  Top 0.178: U$1.P$5 38.15,13.45 39.2,12.4 39.2,4 38.4,3.2 38.05,3.2 C5.1 37.32,3.93 JP2.3
RS2-
  Top 0.178: U$1.P$6 38.3,14.1 39.6,12.8 39.6,3.2 38.4,2 C5.2 37.34,1.39 JP2.1
RS3+
  Top 0.178: U$1.P$10 30.65,13.45 29.6,12.4 29.6,4 30.4,3.2 30.75,3.2 C7.2 31.48,3.93 JP2.4
RS3-
  Top 0.178: U$1.P$9 30.5,14.1 29.2,12.8 29.2,3.2 30.4,2 C7.1 31.46,1.39 JP2.2
RS4+
  Top 0.178: U$1.P$12 30.55,12.15 30,11.6 30,7.6 30.4,7.2 30.75,7.2 C8.2 31.48,6.47 JP2.6
RS4-
  Top 0.178: U$1.P$13 30.7,11.5 30.4,11.2 30.4,8.85 C8.1 31.46,9.01 JP2.8
RST  (via drill 0.25)
  Top 0.178: 17.2,46.8 16.8,47.2 16.8,47.4 16.39,47.81 SJ1.2 | U$5.P$38 27.55,34.35 v27.6,34.4 | v18.5,46.55 18.25,46.8 C42.1 17.2,46.8 | R5.1 17.2,44.4 16.8,44.8 16.8,45.2 16.4,45.6 | 17.2,46.8 16.8,46.4 16.8,46 16.4,45.6 | R24.1 16.4,45.6
  Bottom 0.178: v27.6,34.4 27.6,38.4 28,38.8 28,39.6 27.2,40.4 21.6,40.4 20.8,41.2 19.6,41.2 19.2,41.6 19.2,46 18.65,46.55 v18.5,46.55
S0  (via drill 0.25)
  Top 0.178: U$8.11 36.35,18.85 36.6,18.6 v36.6,18 | v20.4,23.35 20.15,23.35 | 20.15,23.35 v17.6,20.8 | 20.15,23.35 19.7,23.8 19.7,24.35 20.1,24.75 20.1,26.6 19,27.7 19,28.35 18.45,28.9 U$5.P$23
  Bottom 0.178: v36.6,18 36.6,19 38.4,20.8 38.4,23.4 37.4,24.4 34.6,24.4 31.2,27.8 31.2,28.55 30.15,29.6 28.2,29.6 21.95,23.35 v20.4,23.35 | TP12.P$1 v17.6,20.8
S1  (via drill 0.25)
  Top 0.178: U$8.10 36,18.05 v36,17.2 | v18.8,20.8 18.8,21 v20.4,22.6 20.6,22.6 21.2,23.2 21.2,26.8 20.95,27.05 U$5.P$28
  Bottom 0.178: v36,17.2 35.6,17.6 35.6,18.8 38,21.2 38,23.2 37.2,24 34.4,24 30.8,27.6 30.8,28.4 30,29.2 28.4,29.2 22,22.8 20.6,22.8 v20.4,22.6 | TP10.P$1 17.6,19.6 v18.8,20.8
S2  (via drill 0.25)
  Top 0.178: U$8.9 34.65,16.95 34.8,16.8 35.6,16.8 36.8,15.6 v38.4,15.6 | v19,23.8 18,22.8 v18,22 | v20.4,24.1 20.55,24.25 20.55,26.7 19.4,27.85 19.4,28.5 18.95,28.95 U$5.P$24
  Bottom 0.178: v38.4,15.6 39.4,15.6 40.4,16.6 40.4,17.8 38.8,19.4 38.8,23.6 37.6,24.8 34.8,24.8 31.6,28 31.6,28.8 30.4,30 28,30 22.1,24.1 v20.4,24.1 19.3,24.1 v19,23.8 | TP13.P$1 v18,22
SD_PRES  (via drill 0.25)
  Top 0.178: v32.4,23 TP20.P$1 30.8,25.6 30.8,26.8 | 30.8,26.8 30.8,28.7 30.45,29.05 27.65,29.05 27.2,28.6 22.9,28.6 22.45,29.05 U$5.P$31 | R19.1 30.8,26.8
  Bottom 0.178: U2.CD2 33.6,17.45 33.6,21.55 U2.CD1 33.05,22.35 v32.4,23 TP20.P$1
SPI0_MISO  (via drill 0.25)
  Top 0.178: v19.05,26.25 18.2,27.1 18.2,28 17.45,28.75 U$5.P$21 | R27.1 41.2,22.8 v40.8,22.4
  Bottom 0.178: TP3.P$1 48,9.2 47.2,10 47.2,17.8 47.5,18.1 47.5,21.3 46.74,22.06 U2.7 43.54,22.06 43.2,22.4 42.4,22.4 41.55,23.25 | v19.05,26.25 21.85,26.25 27.2,31.6 31.2,31.6 33.2,29.6 33.2,28.8 35.6,26.4 38.4,26.4 41.55,23.25 | v40.8,22.4 40.8,22.5 41.55,23.25
SPI0_MOSI  (via drill 0.25)
  Top 0.178: v19.55,25.25 19.55,25.95 19.6,26 19.6,26.5 18.6,27.5 18.6,28.2 17.95,28.85 U$5.P$22
  Bottom 0.178: TP4.P$1 44,10.8 46,12.8 46,17.2 45.54,17.66 U2.3 41.74,17.66 41.2,18.2 41.1,18.3 39.6,19.8 39.6,24 38,25.6 35.2,25.6 32.4,28.4 32.4,29.2 30.8,30.8 27.6,30.8 22,25.2 19.6,25.2 v19.55,25.25
SPI0_SCK  (via drill 0.25)
  Top 0.178: v18.05,25.6 17.4,26.25 17.4,27.6 16.45,28.55 U$5.P$19
  Bottom 0.178: v18.05,25.6 19.15,25.6 19.35,25.8 19.75,25.8 19.95,25.6 21.8,25.6 27.4,31.2 31,31.2 32.8,29.4 32.8,28.6 35.4,26 38.2,26 40,24.2 40,21.2 41.34,19.86 U2.5 46.14,19.86 47.1,18.9 47.1,18.3 46.4,17.6 TP1.P$1
SPI0_SS  (via drill 0.25)
  Top 0.178: v18.55,24.8 18.65,24.9 18.65,25.85 17.8,26.7 17.8,27.8 16.95,28.65 U$5.P$20 | v40.4,15.2 41.1,14.5 Q1.1 41.65,14.5 R23.1
  Bottom 0.178: v18.55,24.8 18.7,24.65 22.05,24.65 27.8,30.4 30.6,30.4 32,29 32,28.2 35,25.2 37.8,25.2 39.2,23.8 39.2,19.6 42.24,16.56 | TP2.P$1 41.6,15.2 | v40.4,15.2 41.6,15.2 | U2.2 42.24,16.56 | 41.6,15.2 41.6,15.92 42.24,16.56
SPI1_MISO  (via drill 0.25)
  Top 0.178: U$5.P$63 15.95,42.15 15.7,42.4 14.4,42.4 v14,42 13.4,41.4 R28.1 | U$11.P$5 36.6,35.4 35.6,34.4 34.6,34.4 33.6,35.4 v33.6,38
  Bottom 0.178: v33.6,38 33.2,38 28.4,42.8 27,42.8 25.8,44 23.4,44 19.8,47.6 18,47.6 16,45.6 16,44 v14,42 TP9.P$1
SPI1_MOSI  (via drill 0.25)
  Top 0.178: U$11.P$4 36.5,35.9 35.4,34.8 34.8,34.8 34.4,35.2 v34.4,38 | U$5.P$64 v14.4,41.2
  Bottom 0.178: v34.4,38 34.4,37.6 34,37.2 33.4,37.2 28.2,42.4 26.8,42.4 25.6,43.6 23.2,43.6 19.6,47.2 18.2,47.2 16.4,45.4 16.4,43.2 v14.4,41.2 13.6,40.4 TP17.P$1
SPI1_SCK  (via drill 0.25)
  Top 0.178: U$5.P$61 16.95,42.25 17.9,43.2 18.8,43.2 20,44.4 v20.4,44.4 | U$11.P$3 v35.6,36.4
  Bottom 0.178: v20.4,44.4 20.8,44.4 23.6,41.6 27.8,41.6 33,36.4 v35.6,36.4 36,36 36,30.8 TP7.P$1
SPI1_SS  (via drill 0.25)
  Top 0.178: U$5.P$62 16.45,42.35 17.7,43.6 18.4,43.6 20,45.2 v20.4,45.2 20.4,46.3 R26.1 | U$11.P$2 35.9,36.9 v35.6,37.2 | Q2.1 33.05,40.55 v33.2,40.4
  Bottom 0.178: TP8.P$1 19.9,45.7 v20.4,45.2 20.8,45.2 24,42 28,42 33.2,36.8 35.2,36.8 v35.6,37.2 35.6,38 34.8,38.8 33.6,38.8 33.2,39.2 v33.2,40.4
TCK
  Top 0.178: RN2.5 21.7,42.6 21.45,42.35 U$5.P$52
TDI
  Top 0.178: RN2.7 23.4,42.75 23.05,42.4 22.7,42.4 22.45,42.15 U$5.P$50
TDO
  Top 0.178: U$5.P$49 23.32,41.33 24.3,42.3 RN2.8
TMS
  Top 0.178: RN2.6 22.6,42.8 21.95,42.15 U$5.P$51
TRST
  Top 0.178: R25.2 18.15,48.4 SJ1.1
UART7_RX  (via drill 0.25)
  Top 0.178: U$5.P$9 11.95,35.35 10.6,36.7 U$10.3 8.9,36.7 8.4,37.2 v7.6,37.2
  Bottom 0.178: v7.6,37.2 TP23.P$1
UART7_TX  (via drill 0.25)
  Top 0.178: U$5.P$8 12,35.85 11.05,36.8 11.05,37.3 10.65,37.7 U$10.4 8.3,37.7 v8,38
  Bottom 0.178: v8,38 7.2,38 TP22.P$1
V_BATT
  Top 0.178: 23.55,11 23.55,9.85 23.82,9.58 IC2.8 | 23.55,11 24.05,11.5 R2.1 | U$9.3 9.5,14.9 9.8,14.6 | U$9.4 9.88,17.1 R17.2 | C24.1 13.82,14.98 16,12.8 21.2,12.8 23,11 23.55,11
  Top 0.254: C37.1 23.06,8.91 IC2.8
  Top 1.016: 10.18,14.98 9.8,14.6 8.8,13.6 5.2,13.6 2.8,11.2 F1.2 | 10.18,14.98 C24.1 | 10.18,14.98 10,14.98 R17.2
VCC-ISO
  Top 0.203: U$11.P$18 39.6,39.2 38.65,40.15 C30.1 C43.1 38.65,43.05 40.05,44.45 L7.2
  Top 0.23: U$11.P$7 39.1,34.9 38.4,35.6 38.4,37.6 39.6,37.6 | 39.6,37.6 40.8,37.6 41,37.4 U$11.P$15 | U$11.P$18 39.6,37.6
VDD_PA
  Top 0.203: C21.1 42.4,34.05
  Top 0.23: U$11.P$11 42.2,35.4 42.4,35.2 42.4,34.05
  Top 0.61: C21.1 C22.1 44.35,33.75 L4.1
VDDC  (via drill 0.25)
  Top 0.3: U$5.P$56 v19.45,39.85 18.8,39.2 18.8,32 v19.45,31.35 U$5.P$25
  Bottom 0.6: v19.45,31.35 C46.1 C52.1 | v19.45,39.85 C47.1 C51.1
WAKE  (via drill 0.25)
  Top 0.178: v11.4,20.65 11.4,16.75 11.75,16.4 v15.1,16.4 R32.2 | U$5.P$32 23.2,30 v24,30.8
  Bottom 0.178: v24,30.8 23.55,30.35 21.6,30.35 20.45,29.2 14.55,29.2 12,26.65 12,24.9 12.65,24.25 12.65,23.45 11.4,22.2 v11.4,20.65 | TP26.P$1 15.1,15.85 v15.1,16.4

### Text on the board
Top: 1
Route2: 2
Route3: 3
Bottom: 4
tPlace: R25 | JTAG TRST EN | R26 | TRST / TCK / TMS / TDI / TDO / GND / VDD | RESET | C42 / R24 / R5 | Q2 | L7 | GPS | R28 | C26 | NRF_ACT | C43 / C30 | RN2 / RN1 | R31 | C25 | R29 | R21 | C41 / C40 | C23 | L5 / L3 / L4 | C21 | C22 | C17 / C18 | R22 | R30 | C20 | C19 | L2 | C14 | C12 | R19 | Dan Foster / Revision 7A / 03/13/14 | R9 | C45 | C44 | C13 | L1 | C29 | C27 | C9 | C11 | R27 | C48 / C4 | R1 | R17 | C28 | C36 | Q1 | L6 | 5V | C24 | R32 | R18 | R6 | C3 / C2 / C1 | 3.3V | R2 R3 / R10 | R8 / R7 | R23 | SD_ACT | C37 | R20 | F1 | R4 / R11 | C8 / C7 | C6 / C5 | R14 R12 / R13 / R15 R16
bPlace: SPI1_SS | SPI1_MISO | SPI1_MOSI | GPS_EN | C47 / C51 / C15 / C34 | C33 / C10 | I2C0_SDA | UART7_TX | UART7_RX | C49 / C50 | NRF_IRQ | C32 / C38 | I2C0_SCL | NRF_EN | PC7 | C46 / C52 | SPI1_SCK | PA1 | C31 / C39 / C16 / C35 | PF2 | SD_PRES | GND / 3.3V | S0 / S1 | S2 / AIN0 | WAKE | 5V | SPI0_SS / SPI0_MOSI / SPI0_SCK / SPI0_MISO | OE